# Altium project RK3568_train.PrjPcb (part 3 of 6)

## Sheet SOC_COMPHY_USB.schdoc: =
size A3; Symbol: Sheet-Symbol_A4; Company: 嘉立创EDA; Version: V1.0; Page Size: A4; @Project Name: RK3568_LPD4X_120P_Core; @Page Count: 18; @Update Date: 2025-08-22; @Create Date: 2025-08-15; @Schematic Name: Schematic1; @Page No: 8; @Page Name: SOC_COMPHY/USB; Device: Sheet-Symbol_A4; Border: 1; Title Block Position: 3; Width: 1655; Height: 1170; Region Start: 1; X Region Count: 6; Y Region Count: 4; Blade Width: 10; @Board Name: Board1; @Create Time: 13:46:06; @Update Time: 16:42:04; Organization: ORGANIZATION; Address1: ADDRESS 1; Address2: ADDRESS 2; Address3: ADDRESS 3; Address4: ADDRESS 4; Revision: V1.0.0; SheetNumber: 10; SheetTotal: 28
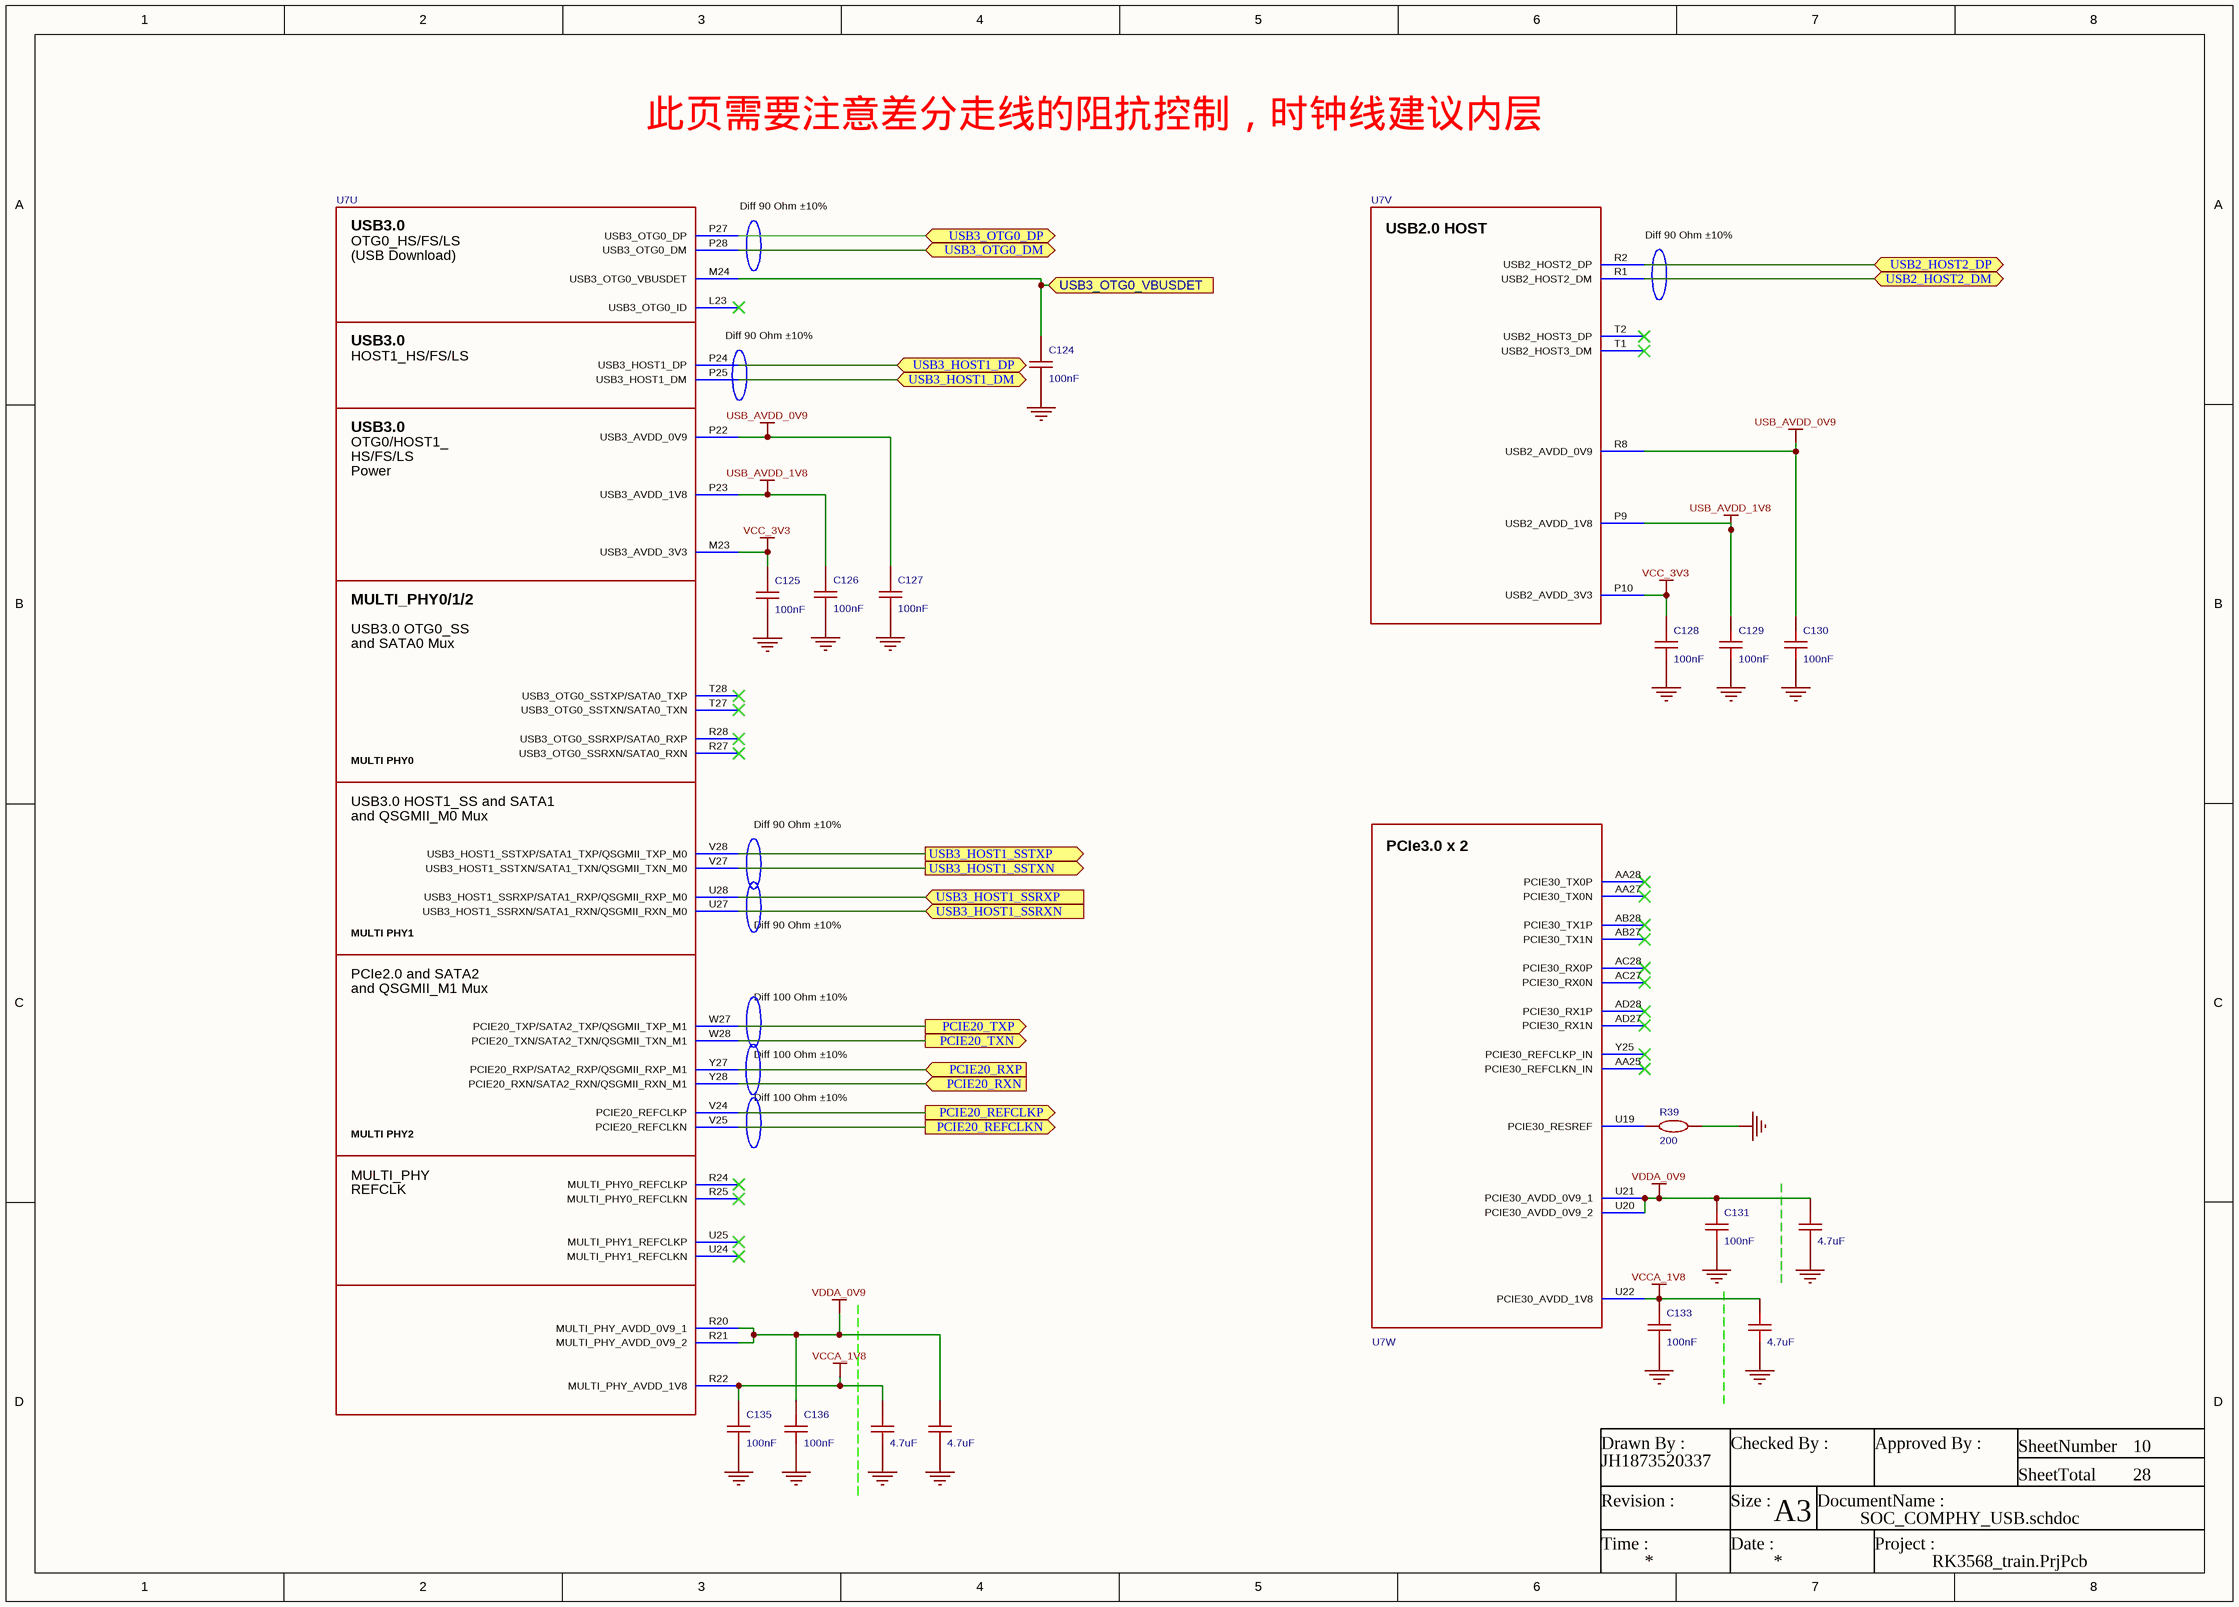
[diagram p9: SOC_COMPHY_USB.schdoc]

### Parts
C124  100nF  [C0201]
C125  100nF  [C0201]
C126  100nF  [C0201]
C127  100nF  [C0201]
C128  100nF  [C0201]
C129  100nF  [C0201]
C130  100nF  [C0201]
C131  100nF  [C0201]
C132  value 4.7uF  [MYC0402]  (hidden comment: CL10A105KB8NNNC)
C133  100nF  [C0201]
C134  value 4.7uF  [MYC0402]  (hidden comment: CL10A105KB8NNNC)
C135  100nF  [C0201]
C136  100nF  [C0201]
C137  value 4.7uF  [MYC0402]  (hidden comment: CL10A105KB8NNNC)
C138  value 4.7uF  [MYC0402]  (hidden comment: CL10A105KB8NNNC)
R39  200  [R0201]
U7  RK3568  [BGA-636_L19.0-W19.0-P0.65-BL]  (value not drawn)  (parts U,V,W of 23)

### Ports
PCIE20_REFCLKN (out), PCIE20_REFCLKP (out), PCIE20_RXN (in), PCIE20_RXP (in), PCIE20_TXN (out), PCIE20_TXP (out), USB2_HOST2_DM (bidir), USB2_HOST2_DP (bidir), USB3_HOST1_DM (bidir), USB3_HOST1_DP (bidir), USB3_HOST1_SSRXN (in), USB3_HOST1_SSRXP (in), USB3_HOST1_SSTXN (out), USB3_HOST1_SSTXP (out), USB3_OTG0_DM (bidir), USB3_OTG0_DP (bidir), USB3_OTG0_VBUSDET (in)

### Nets
GND: C124.1 C125.1 C126.1 C127.1 C128.1 C129.1 C130.1 C131.1 C132.1 C133.1 C134.1 C135.1 C136.1 C137.1 C138.1 R39.2
USB_AVDD_0V9: C127.2 C130.2 U7.P22(USB3_AVDD_0V9) U7.R8(USB2_AVDD_0V9)
USB_AVDD_1V8: C126.2 C129.2 U7.P9(USB2_AVDD_1V8) U7.P23(USB3_AVDD_1V8)
VCC_3V3: C125.2 C128.2 U7.M23(USB3_AVDD_3V3) U7.P10(USB2_AVDD_3V3)  [project net TP_3V3]
VCCA_1V8: C133.2 C134.2 C135.2 C137.2 U7.R22(MULTI_PHY_AVDD_1V8) U7.U22(PCIE30_AVDD_1V8)
VDDA_0V9: C131.2 C132.2 C136.2 C138.2 U7.R20(MULTI_PHY_AVDD_0V9_1) U7.R21(MULTI_PHY_AVDD_0V9_2) U7.U20(PCIE30_AVDD_0V9_2) U7.U21(PCIE30_AVDD_0V9_1)
PCIE20_REFCLKN: U7.V25(PCIE20_REFCLKN) ; port PCIE20_REFCLKN
PCIE20_REFCLKP: U7.V24(PCIE20_REFCLKP) ; port PCIE20_REFCLKP
PCIE20_RXN: U7.Y28(PCIE20_RXN/SATA2_RXN/QSGMII_RXN_M1) ; port PCIE20_RXN
PCIE20_RXP: U7.Y27(PCIE20_RXP/SATA2_RXP/QSGMII_RXP_M1) ; port PCIE20_RXP
PCIE20_TXN: U7.W28(PCIE20_TXN/SATA2_TXN/QSGMII_TXN_M1) ; port PCIE20_TXN
PCIE20_TXP: U7.W27(PCIE20_TXP/SATA2_TXP/QSGMII_TXP_M1) ; port PCIE20_TXP
USB2_HOST2_DM: U7.R1(USB2_HOST2_DM) ; port USB2_HOST2_DM
USB2_HOST2_DP: U7.R2(USB2_HOST2_DP) ; port USB2_HOST2_DP
USB3_HOST1_DM: U7.P25(USB3_HOST1_DM) ; port USB3_HOST1_DM
USB3_HOST1_DP: U7.P24(USB3_HOST1_DP) ; port USB3_HOST1_DP
USB3_HOST1_SSRXN: U7.U27(USB3_HOST1_SSRXN/SATA1_RXN/QSGMII_RXN_M0) ; port USB3_HOST1_SSRXN
USB3_HOST1_SSRXP: U7.U28(USB3_HOST1_SSRXP/SATA1_RXP/QSGMII_RXP_M0) ; port USB3_HOST1_SSRXP
USB3_HOST1_SSTXN: U7.V27(USB3_HOST1_SSTXN/SATA1_TXN/QSGMII_TXN_M0) ; port USB3_HOST1_SSTXN
USB3_HOST1_SSTXP: U7.V28(USB3_HOST1_SSTXP/SATA1_TXP/QSGMII_TXP_M0) ; port USB3_HOST1_SSTXP
USB3_OTG0_DM: U7.P28(USB3_OTG0_DM) ; port USB3_OTG0_DM
USB3_OTG0_DP: U7.P27(USB3_OTG0_DP) ; port USB3_OTG0_DP
USB3_OTG0_VBUSDET: C124.2 U7.M24(USB3_OTG0_VBUSDET) ; port USB3_OTG0_VBUSDET
NetR39_1: R39.1 U7.U19(PCIE30_RESREF)

Not connected (* = marked no-connect by the designer): U7 AA25(PCIE30_REFCLKN_IN)* AA27(PCIE30_TX0N)* AA28(PCIE30_TX0P)* AB27(PCIE30_TX1N)* AB28(PCIE30_TX1P)* AC27(PCIE30_RX0N)* AC28(PCIE30_RX0P)* AD27(PCIE30_RX1N)* AD28(PCIE30_RX1P)* L23(USB3_OTG0_ID)* R24(MULTI_PHY0_REFCLKP)* R25(MULTI_PHY0_REFCLKN)* R27(USB3_OTG0_SSRXN/SATA0_RXN)* R28(USB3_OTG0_SSRXP/SATA0_RXP)* T1(USB2_HOST3_DM)* T2(USB2_HOST3_DP)* T27(USB3_OTG0_SSTXN/SATA0_TXN)* T28(USB3_OTG0_SSTXP/SATA0_TXP)* U24(MULTI_PHY1_REFCLKN)* U25(MULTI_PHY1_REFCLKP)* Y25(PCIE30_REFCLKP_IN)*

### Notes on the sheet
- 此页需要注意差分走线的阻抗控制，时钟线建议内层
- (near U7) Diff 90 Ohm ±10%
- Diff 90 Ohm ±10%
- Diff 100 Ohm ±10%
- Drawn By :
- Checked By :
- Approved By :
- SheetNumber
- SheetTotal
- Revision :
- Time :
- Size :
- Date :
- A3
- DocumentName :
- Project :
- (in symbol RK3568, part U) USB3.0; OTG0_HS/FS/LS; (USB Download); HOST1_HS/FS/LS; OTG0/HOST1_; HS/FS/LS; Power; MULTI_PHY0/1/2; USB3.0 OTG0_SS; and SATA0 Mux; MULTI PHY0; USB3.0 HOST1_SS and SATA1; and QSGMII_M0 Mux; MULTI PHY1; PCIe2.0 and SATA2; and QSGMII_M1 Mux; MULTI PHY2; MULTI_PHY; REFCLK
- (in symbol RK3568, part V) USB2.0 HOST
- (in symbol RK3568, part W) PCIe3.0 x 2

### Library data of the parts
C124-C131 C133 C135 C136 = GRM035R60J475ME15D: 容值:4.7uF;精度:±20%;额定电压:6.3V;温度系数:X5R;; Manufacturer: muRata(村田); AddInBom: yes; ModelId: e8033a7cb35143ffb28e3b81b2577ea0; ModelName: C0201_L0.6-W0.3-H0.3; ModelTransform: 23.622,11.811,0,0,0,0,0,0,0; Tolerance: ±20%; Voltage Rating: 6.3V; Temperature Coefficient: X5R; Symbol: GRM035R60J475ME15D; Value: 100nF; Device: GRM035R60J475ME15D; LCSC Part Name: 4.7uF ±20% 6.3V; ManufacturerPart: GRM035R60J475ME15D; Supplier Footprint: 0201; JLCPCB Part Class: Extended Part; Datasheet: https://item.szlcsc.com/datasheet/GRM035R60J475ME15D/313624.html; Supplier: LCSC; ConvertToPcb: yes; FootprintName: C0201
C132 C134 C137 C138 = CL10A105KB8NNNC: 容值:1uF;精度:±10%;额定电压:50V;材质(温度系数):X5R;; Manufacturer: SAMSUNG(三星); Symbol: CapAcitance; 3D Model: 36a51122f27c49738f86b3bfa98863e0; AddInBom: yes; ModelName: C0603_L1.6-W0.8-H0.8; ModelTransform: 62.992,31.496,0,0,0,0,0,0,0; Tolerance: ±10%; Voltage Rated: 50V; Temperature Coefficient: X5R; Device: CL10A105KB8NNNC; LCSC Part Name: 1uF ±10% 50V; ManufacturerPart: CL10A105KB8NNNC; Supplier Footprint: 0603; JLCPCB Part Class: Basic Part; Datasheet: https://atta.szlcsc.com/upload/public/pdf/source/20160103/1457707679084.pdf; Supplier: LCSC; ConvertToPcb: yes; FootprintName: MYC0402
R39 = Res_0201: ConvertToPcb: yes; SymbolName: 电阻; ModelId: 0e006ba4c37b4b73b0e85d5d1c6800cb; ModelName: R0201_L0.6-W0.3-H0.3; ModelTransform: 23.622,11.811,0,0,0,0,0,-0.0005,0; Value: 200; Device: Res_0201; AddInBom: yes; Supplier Footprint: 0201; FootprintName: R0201
U7 = RK3568: ConvertToPcb: yes; ModelId: e6756cba1b9f43448429fdcd1d44d9d9; ModelTransform: 748.03,748.03,54.33,0,0,0,0,0,0; Symbol: RK3568; Device: RK3568; AddInBom: yes; FootprintName: BGA-636_L19.0-W19.0-P0.65-BL; ModelName: BGA-636_L19.0-W19.0-P0.65-BL

## Sheet SOC_DDR.schdoc: =
size A3; Symbol: Sheet-Symbol_A4; Company: 嘉立创EDA; Version: V1.0; Page Size: A4; @Project Name: RK3568B2地瓜派; @Page Count: 27; @Update Date: 2025-09-11; @Create Date: 2025-09-11; @Schematic Name: Schematic1; @Page No: 6; @Page Name: SOC_DDR; Device: Sheet-Symbol_A4; Border: 1; Title Block Position: 3; Width: 1655; Height: 1170; Region Start: 1; X Region Count: 6; Y Region Count: 4; Blade Width: 10; @Board Name: Board1; @Create Time: 22:14:45; @Update Time: 22:15:05; Organization: ORGANIZATION; Address1: ADDRESS 1; Address2: ADDRESS 2; Address3: ADDRESS 3; Address4: ADDRESS 4; Revision: V1.0.0; SheetNumber: 11; SheetTotal: 28
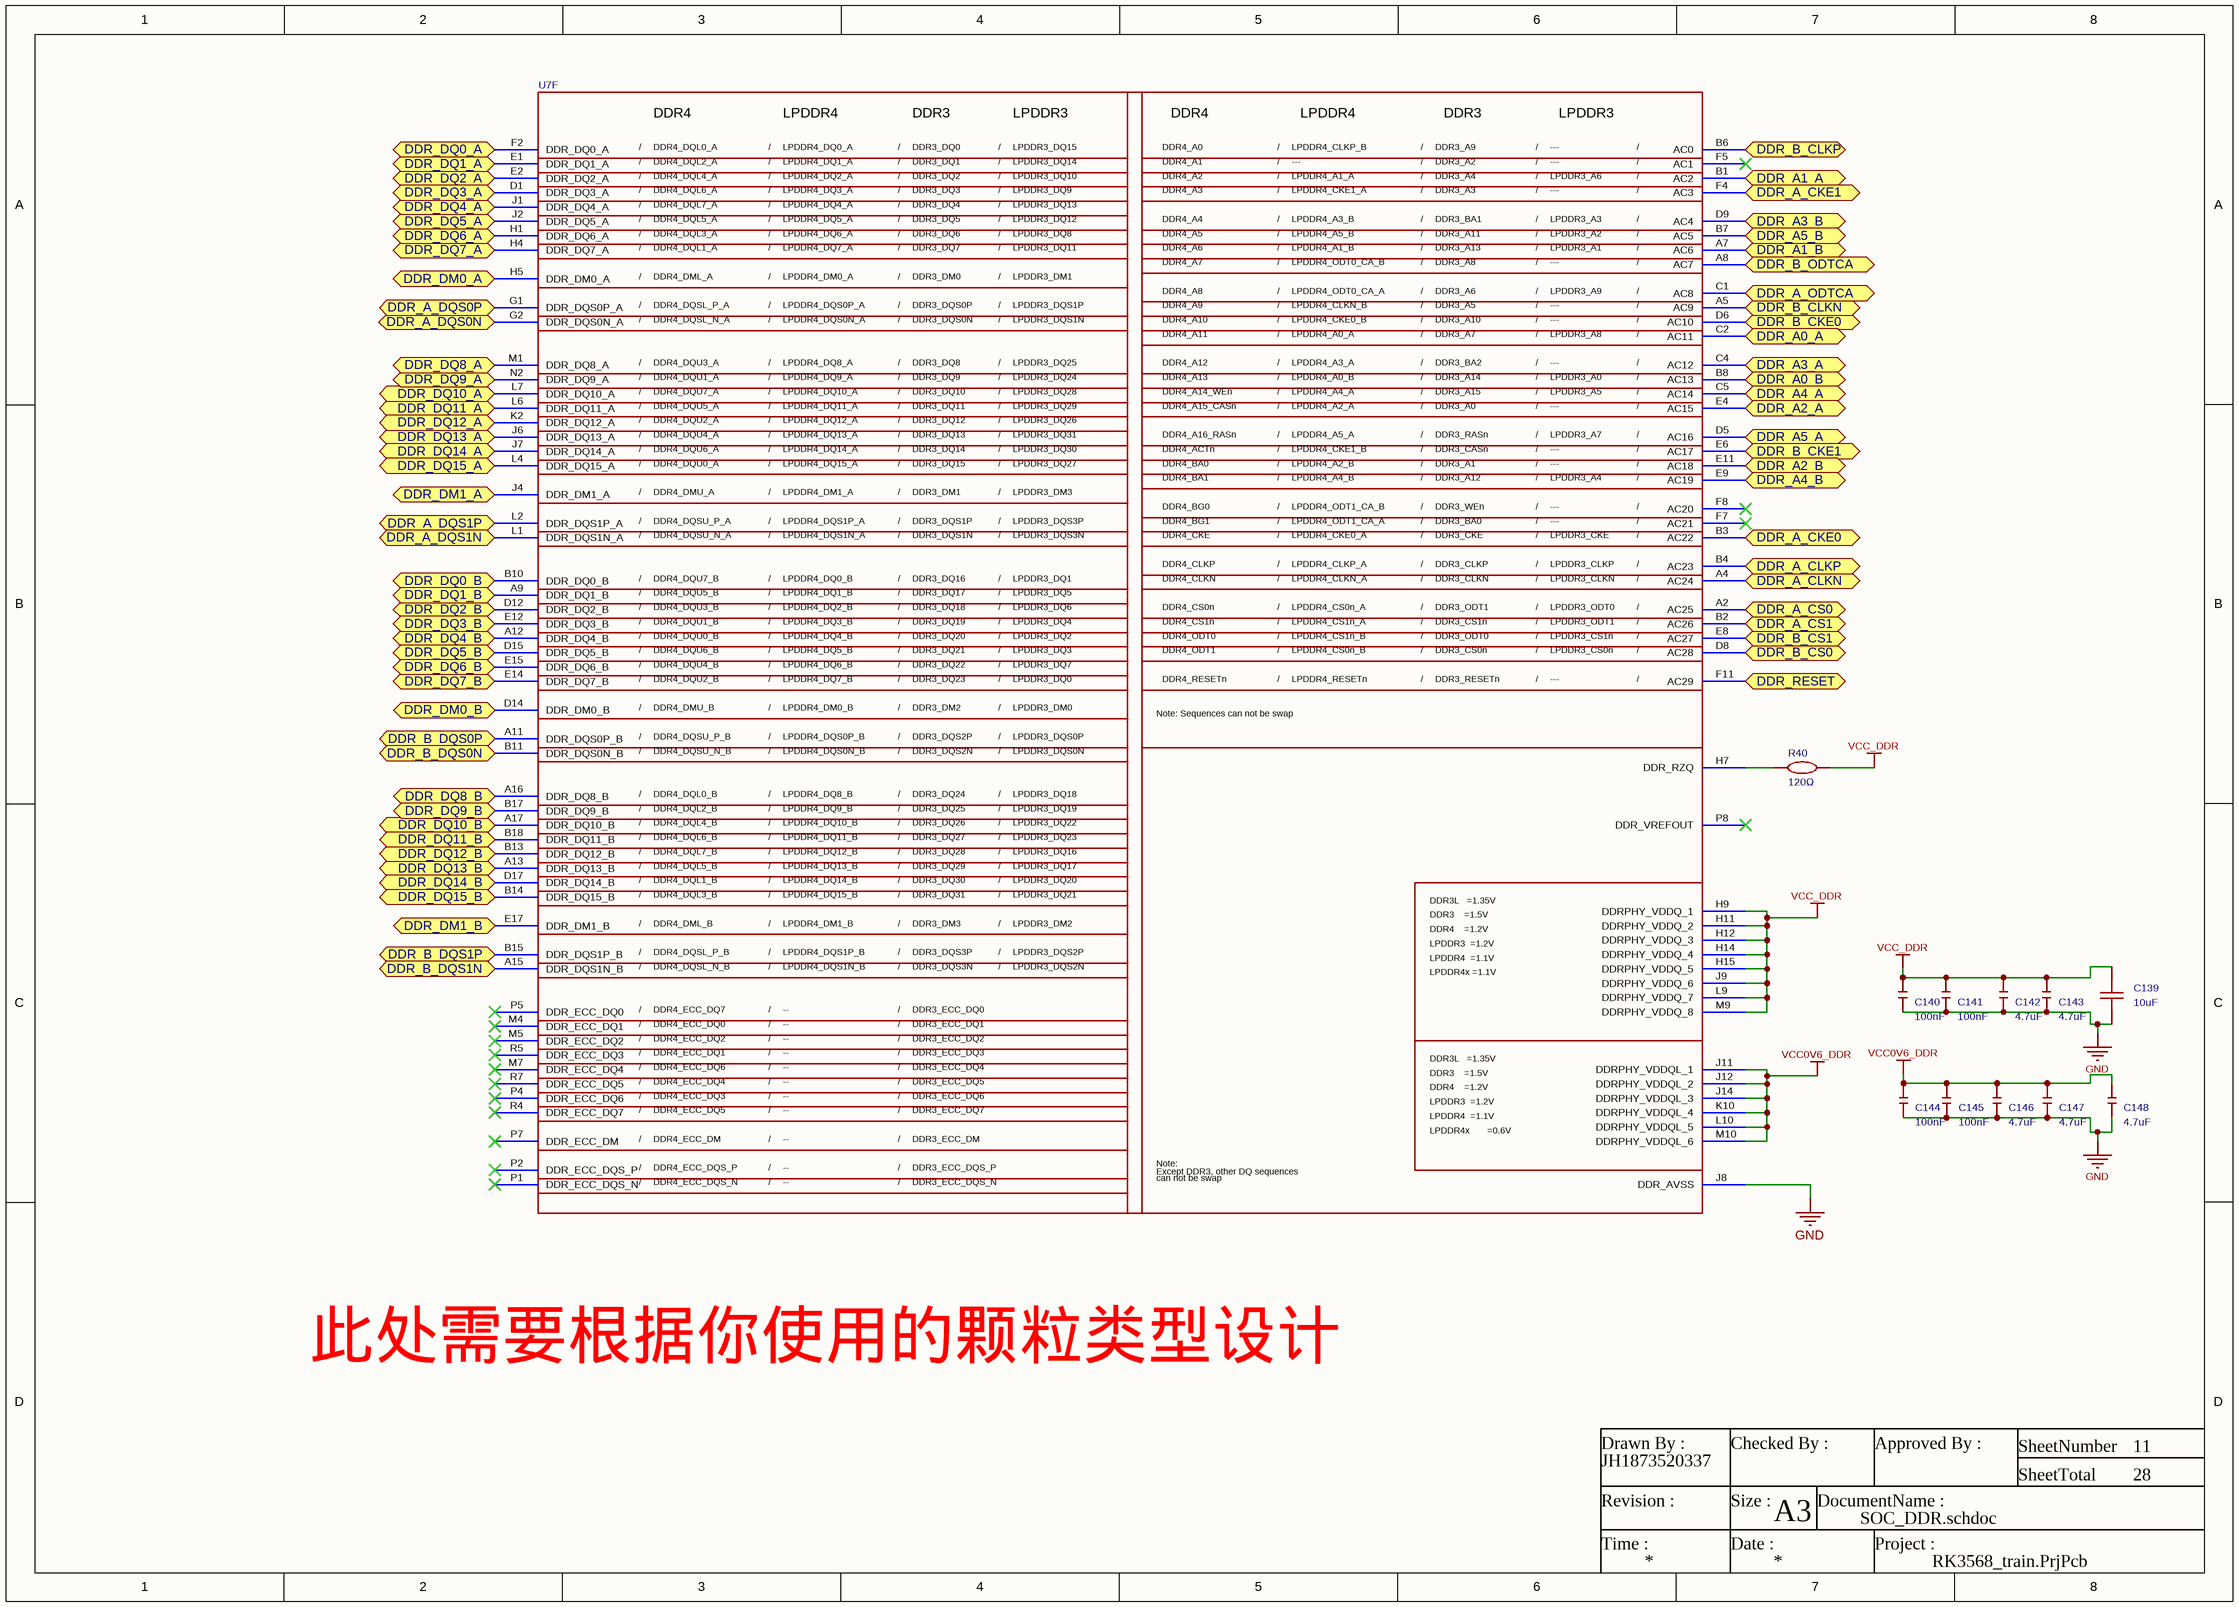
[diagram p10: SOC_DDR.schdoc]

### Parts
C139  10uF  [C0603]
C140  100nF  [MYC0201]
C141  100nF  [MYC0201]
C142  4.7uF  [MYC0402]
C143  4.7uF  [MYC0402]
C144  100nF  [MYC0201]
C145  100nF  [MYC0201]
C146  4.7uF  [MYC0402]
C147  4.7uF  [MYC0402]
C148  4.7uF  [MYC0402]
R40  120Ω  [R0201]
U7  RK3568  [BGA-636_L19.0-W19.0-P0.65-BL]  (value not drawn)  (part F of 23)

### Ports
DDR_A0_A (bidir), DDR_A0_B (bidir), DDR_A1_A (bidir), DDR_A1_B (bidir), DDR_A2_A (bidir), DDR_A2_B (bidir), DDR_A3_A (bidir), DDR_A3_B (bidir), DDR_A4_A (bidir), DDR_A4_B (bidir), DDR_A5_A (bidir), DDR_A5_B (bidir), DDR_A_CKE0 (bidir), DDR_A_CKE1 (bidir), DDR_A_CLKN (bidir), DDR_A_CLKP (bidir), DDR_A_CS0 (bidir), DDR_A_CS1 (bidir), DDR_A_DQS0N (bidir), DDR_A_DQS0P (bidir), DDR_A_DQS1N (bidir), DDR_A_DQS1P (bidir), DDR_A_ODTCA (bidir), DDR_B_CKE0 (bidir), DDR_B_CKE1 (bidir), DDR_B_CLKN (bidir), DDR_B_CLKP (bidir), DDR_B_CS0 (bidir), DDR_B_CS1 (bidir), DDR_B_DQS0N (bidir), DDR_B_DQS0P (bidir), DDR_B_DQS1N (bidir), DDR_B_DQS1P (bidir), DDR_B_ODTCA (bidir), DDR_DM0_A (bidir), DDR_DM0_B (bidir), DDR_DM1_A (bidir), DDR_DM1_B (bidir), DDR_DQ0_A (bidir), DDR_DQ0_B (bidir), DDR_DQ1_A (bidir), DDR_DQ1_B (bidir), DDR_DQ2_A (bidir), DDR_DQ2_B (bidir), DDR_DQ3_A (bidir), DDR_DQ3_B (bidir), DDR_DQ4_A (bidir), DDR_DQ4_B (bidir), DDR_DQ5_A (bidir), DDR_DQ5_B (bidir), DDR_DQ6_A (bidir), DDR_DQ6_B (bidir), DDR_DQ7_A (bidir), DDR_DQ7_B (bidir), DDR_DQ8_A (bidir), DDR_DQ8_B (bidir), DDR_DQ9_A (bidir), DDR_DQ9_B (bidir), DDR_DQ10_A (bidir), DDR_DQ10_B (bidir), DDR_DQ11_A (bidir), DDR_DQ11_B (bidir), DDR_DQ12_A (bidir), DDR_DQ12_B (bidir), DDR_DQ13_A (bidir), DDR_DQ13_B (bidir), DDR_DQ14_A (bidir), DDR_DQ14_B (bidir), DDR_DQ15_A (bidir), DDR_DQ15_B (bidir), DDR_RESET (bidir)

### Nets
GND: C139.1 C140.1 C141.1 C142.1 C143.1 C144.1 C145.1 C146.1 C147.1 C148.1 U7.J8(DDR_AVSS)
VCC0V6_DDR: C144.2 C145.2 C146.2 C147.2 C148.2 U7.J11(DDRPHY_VDDQL_1) U7.J12(DDRPHY_VDDQL_2) U7.J14(DDRPHY_VDDQL_3) U7.K10(DDRPHY_VDDQL_4) U7.L10(DDRPHY_VDDQL_5) U7.M10(DDRPHY_VDDQL_6)
VCC_DDR: C139.2 C140.2 C141.2 C142.2 C143.2 R40.2 U7.H9(DDRPHY_VDDQ_1) U7.H11(DDRPHY_VDDQ_2) U7.H12(DDRPHY_VDDQ_3) U7.H14(DDRPHY_VDDQ_4) U7.H15(DDRPHY_VDDQ_5) U7.J9(DDRPHY_VDDQ_6) U7.L9(DDRPHY_VDDQ_7) U7.M9(DDRPHY_VDDQ_8)
DDR_A0_A: U7.C2(AC11) ; port DDR_A0_A
DDR_A0_B: U7.B8(AC13) ; port DDR_A0_B
DDR_A1_A: U7.B1(AC2) ; port DDR_A1_A
DDR_A1_B: U7.A7(AC6) ; port DDR_A1_B
DDR_A2_A: U7.E4(AC15) ; port DDR_A2_A
DDR_A2_B: U7.E11(AC18) ; port DDR_A2_B
DDR_A3_A: U7.C4(AC12) ; port DDR_A3_A
DDR_A3_B: U7.D9(AC4) ; port DDR_A3_B
DDR_A4_A: U7.C5(AC14) ; port DDR_A4_A
DDR_A4_B: U7.E9(AC19) ; port DDR_A4_B
DDR_A5_A: U7.D5(AC16) ; port DDR_A5_A
DDR_A5_B: U7.B7(AC5) ; port DDR_A5_B
DDR_A_CKE0: U7.B3(AC22) ; port DDR_A_CKE0
DDR_A_CKE1: U7.F4(AC3) ; port DDR_A_CKE1
DDR_A_CLKN: U7.A4(AC24) ; port DDR_A_CLKN
DDR_A_CLKP: U7.B4(AC23) ; port DDR_A_CLKP
DDR_A_CS0: U7.A2(AC25) ; port DDR_A_CS0
DDR_A_CS1: U7.B2(AC26) ; port DDR_A_CS1
DDR_A_DQS0N: U7.G2(DDR_DQS0N_A) ; port DDR_A_DQS0N
DDR_A_DQS0P: U7.G1(DDR_DQS0P_A) ; port DDR_A_DQS0P
DDR_A_DQS1N: U7.L1(DDR_DQS1N_A) ; port DDR_A_DQS1N
DDR_A_DQS1P: U7.L2(DDR_DQS1P_A) ; port DDR_A_DQS1P
DDR_A_ODTCA: U7.C1(AC8) ; port DDR_A_ODTCA
DDR_B_CKE0: U7.D6(AC10) ; port DDR_B_CKE0
DDR_B_CKE1: U7.E6(AC17) ; port DDR_B_CKE1
DDR_B_CLKN: U7.A5(AC9) ; port DDR_B_CLKN
DDR_B_CLKP: U7.B6(AC0) ; port DDR_B_CLKP
DDR_B_CS0: U7.D8(AC28) ; port DDR_B_CS0
DDR_B_CS1: U7.E8(AC27) ; port DDR_B_CS1
DDR_B_DQS0N: U7.B11(DDR_DQS0N_B) ; port DDR_B_DQS0N
DDR_B_DQS0P: U7.A11(DDR_DQS0P_B) ; port DDR_B_DQS0P
DDR_B_DQS1N: U7.A15(DDR_DQS1N_B) ; port DDR_B_DQS1N
DDR_B_DQS1P: U7.B15(DDR_DQS1P_B) ; port DDR_B_DQS1P
DDR_B_ODTCA: U7.A8(AC7) ; port DDR_B_ODTCA
DDR_DM0_A: U7.H5(DDR_DM0_A) ; port DDR_DM0_A
DDR_DM0_B: U7.D14(DDR_DM0_B) ; port DDR_DM0_B
DDR_DM1_A: U7.J4(DDR_DM1_A) ; port DDR_DM1_A
DDR_DM1_B: U7.E17(DDR_DM1_B) ; port DDR_DM1_B
DDR_DQ0_A: U7.F2(DDR_DQ0_A) ; port DDR_DQ0_A
DDR_DQ0_B: U7.B10(DDR_DQ0_B) ; port DDR_DQ0_B
DDR_DQ1_A: U7.E1(DDR_DQ1_A) ; port DDR_DQ1_A
DDR_DQ1_B: U7.A9(DDR_DQ1_B) ; port DDR_DQ1_B
DDR_DQ2_A: U7.E2(DDR_DQ2_A) ; port DDR_DQ2_A
DDR_DQ2_B: U7.D12(DDR_DQ2_B) ; port DDR_DQ2_B
DDR_DQ3_A: U7.D1(DDR_DQ3_A) ; port DDR_DQ3_A
DDR_DQ3_B: U7.E12(DDR_DQ3_B) ; port DDR_DQ3_B
DDR_DQ4_A: U7.J1(DDR_DQ4_A) ; port DDR_DQ4_A
DDR_DQ4_B: U7.A12(DDR_DQ4_B) ; port DDR_DQ4_B
DDR_DQ5_A: U7.J2(DDR_DQ5_A) ; port DDR_DQ5_A
DDR_DQ5_B: U7.D15(DDR_DQ5_B) ; port DDR_DQ5_B
DDR_DQ6_A: U7.H1(DDR_DQ6_A) ; port DDR_DQ6_A
DDR_DQ6_B: U7.E15(DDR_DQ6_B) ; port DDR_DQ6_B
DDR_DQ7_A: U7.H4(DDR_DQ7_A) ; port DDR_DQ7_A
DDR_DQ7_B: U7.E14(DDR_DQ7_B) ; port DDR_DQ7_B
DDR_DQ8_A: U7.M1(DDR_DQ8_A) ; port DDR_DQ8_A
DDR_DQ8_B: U7.A16(DDR_DQ8_B) ; port DDR_DQ8_B
DDR_DQ9_A: U7.N2(DDR_DQ9_A) ; port DDR_DQ9_A
DDR_DQ9_B: U7.B17(DDR_DQ9_B) ; port DDR_DQ9_B
DDR_DQ10_A: U7.L7(DDR_DQ10_A) ; port DDR_DQ10_A
DDR_DQ10_B: U7.A17(DDR_DQ10_B) ; port DDR_DQ10_B
DDR_DQ11_A: U7.L6(DDR_DQ11_A) ; port DDR_DQ11_A
DDR_DQ11_B: U7.B18(DDR_DQ11_B) ; port DDR_DQ11_B
DDR_DQ12_A: U7.K2(DDR_DQ12_A) ; port DDR_DQ12_A
DDR_DQ12_B: U7.B13(DDR_DQ12_B) ; port DDR_DQ12_B
DDR_DQ13_A: U7.J6(DDR_DQ13_A) ; port DDR_DQ13_A
DDR_DQ13_B: U7.A13(DDR_DQ13_B) ; port DDR_DQ13_B
DDR_DQ14_A: U7.J7(DDR_DQ14_A) ; port DDR_DQ14_A
DDR_DQ14_B: U7.D17(DDR_DQ14_B) ; port DDR_DQ14_B
DDR_DQ15_A: U7.L4(DDR_DQ15_A) ; port DDR_DQ15_A
DDR_DQ15_B: U7.B14(DDR_DQ15_B) ; port DDR_DQ15_B
DDR_RESET: U7.F11(AC29) ; port DDR_RESET
NetR40_1: R40.1 U7.H7(DDR_RZQ)

Not connected (* = marked no-connect by the designer): U7 F5(AC1)* F7(AC21)* F8(AC20)* M4(DDR_ECC_DQ1)* M5(DDR_ECC_DQ2)* M7(DDR_ECC_DQ4)* P1(DDR_ECC_DQS_N)* P2(DDR_ECC_DQS_P)* P4(DDR_ECC_DQ6)* P5(DDR_ECC_DQ0)* P7(DDR_ECC_DM)* P8(DDR_VREFOUT)* R4(DDR_ECC_DQ7)* R5(DDR_ECC_DQ3)* R7(DDR_ECC_DQ5)*

### Notes on the sheet
- 此处需要根据你使用的颗粒类型设计
- Drawn By :
- Checked By :
- Approved By :
- SheetNumber
- SheetTotal
- Revision :
- Time :
- Size :
- Date :
- A3
- DocumentName :
- Project :
- (in symbol RK3568, part F) DDR4; LPDDR4; DDR3; LPDDR3; /; DDR4_DQL0_A; LPDDR4_DQ0_A; DDR3_DQ0; LPDDR3_DQ15; DDR4_A0; LPDDR4_CLKP_B; DDR3_A9; ---; DDR4_DQL2_A; LPDDR4_DQ1_A; DDR3_DQ1; LPDDR3_DQ14; DDR4_A1; DDR3_A2; DDR4_DQL4_A; LPDDR4_DQ2_A; DDR3_DQ2; LPDDR3_DQ10; DDR4_A2; LPDDR4_A1_A; DDR3_A4; LPDDR3_A6; DDR4_DQL6_A; LPDDR4_DQ3_A; DDR3_DQ3; LPDDR3_DQ9; DDR4_A3; LPDDR4_CKE1_A; DDR3_A3; DDR4_DQL7_A; LPDDR4_DQ4_A; DDR3_DQ4; LPDDR3_DQ13; DDR4_DQL5_A; LPDDR4_DQ5_A; DDR3_DQ5; LPDDR3_DQ12; DDR4_A4; LPDDR4_A3_B; DDR3_BA1; LPDDR3_A3; DDR4_DQL3_A; LPDDR4_DQ6_A; DDR3_DQ6; LPDDR3_DQ8; DDR4_A5; LPDDR4_A5_B; DDR3_A11; LPDDR3_A2; DDR4_DQL1_A; LPDDR4_DQ7_A; DDR3_DQ7; LPDDR3_DQ11; DDR4_A6; LPDDR4_A1_B; DDR3_A13; LPDDR3_A1; DDR4_A7; LPDDR4_ODT0_CA_B; DDR3_A8; DDR4_DML_A; LPDDR4_DM0_A; DDR3_DM0; LPDDR3_DM1; DDR4_A8; LPDDR4_ODT0_CA_A; DDR3_A6; LPDDR3_A9; DDR4_DQSL_P_A; LPDDR4_DQS0P_A; DDR3_DQS0P; LPDDR3_DQS1P; DDR4_A9; LPDDR4_CLKN_B; DDR3_A5; DDR4_DQSL_N_A; LPDDR4_DQS0N_A; DDR3_DQS0N; LPDDR3_DQS1N; DDR4_A10; LPDDR4_CKE0_B; DDR3_A10; DDR4_A11; LPDDR4_A0_A; DDR3_A7; LPDDR3_A8; DDR4_DQU3_A; LPDDR4_DQ8_A; DDR3_DQ8; LPDDR3_DQ25; DDR4_A12; LPDDR4_A3_A; DDR3_BA2; DDR4_DQU1_A; LPDDR4_DQ9_A; DDR3_DQ9; LPDDR3_DQ24; DDR4_A13; LPDDR4_A0_B; DDR3_A14; LPDDR3_A0; DDR4_DQU7_A; LPDDR4_DQ10_A; DDR3_DQ10; LPDDR3_DQ28; DDR4_A14_WEn; LPDDR4_A4_A; DDR3_A15; LPDDR3_A5; DDR4_DQU5_A; LPDDR4_DQ11_A; DDR3_DQ11; LPDDR3_DQ29; DDR4_A15_CASn; LPDDR4_A2_A; DDR3_A0; DDR4_DQU2_A; LPDDR4_DQ12_A; DDR3_DQ12; LPDDR3_DQ26; DDR4_DQU4_A; LPDDR4_DQ13_A; DDR3_DQ13; LPDDR3_DQ31; DDR4_A16_RASn; LPDDR4_A5_A; DDR3_RASn; LPDDR3_A7; DDR4_DQU6_A; LPDDR4_DQ14_A; DDR3_DQ14; LPDDR3_DQ30; DDR4_ACTn; LPDDR4_CKE1_B; DDR3_CASn; DDR4_DQU0_A; LPDDR4_DQ15_A; DDR3_DQ15; LPDDR3_DQ27; DDR4_BA0; LPDDR4_A2_B; DDR3_A1; DDR4_BA1; LPDDR4_A4_B; DDR3_A12; LPDDR3_A4; DDR4_DMU_A; LPDDR4_DM1_A; DDR3_DM1; LPDDR3_DM3; DDR4_BG0; LPDDR4_ODT1_CA_B; DDR3_WEn; DDR4_DQSU_P_A; LPDDR4_DQS1P_A; DDR3_DQS1P; LPDDR3_DQS3P; DDR4_BG1; LPDDR4_ODT1_CA_A; DDR3_BA0; DDR4_DQSU_N_A; LPDDR4_DQS1N_A; DDR3_DQS1N; LPDDR3_DQS3N; DDR4_CKE; LPDDR4_CKE0_A; DDR3_CKE; LPDDR3_CKE; DDR4_CLKP; LPDDR4_CLKP_A; DDR3_CLKP; LPDDR3_CLKP; DDR4_DQU7_B; LPDDR4_DQ0_B; DDR3_DQ16; LPDDR3_DQ1; DDR4_CLKN; LPDDR4_CLKN_A; DDR3_CLKN; LPDDR3_CLKN; DDR4_DQU5_B; LPDDR4_DQ1_B; DDR3_DQ17; LPDDR3_DQ5; DDR4_DQU3_B; LPDDR4_DQ2_B; DDR3_DQ18; LPDDR3_DQ6; DDR4_CS0n; LPDDR4_CS0n_A; DDR3_ODT1; LPDDR3_ODT0; DDR4_DQU1_B; LPDDR4_DQ3_B; DDR3_DQ19; LPDDR3_DQ4; DDR4_CS1n; LPDDR4_CS1n_A; DDR3_CS1n; LPDDR3_ODT1; DDR4_DQU0_B; LPDDR4_DQ4_B; DDR3_DQ20; LPDDR3_DQ2; DDR4_ODT0; LPDDR4_CS1n_B; DDR3_ODT0; LPDDR3_CS1n; DDR4_DQU6_B; LPDDR4_DQ5_B; DDR3_DQ21; LPDDR3_DQ3; DDR4_ODT1; LPDDR4_CS0n_B; DDR3_CS0n; LPDDR3_CS0n; DDR4_DQU4_B; LPDDR4_DQ6_B; DDR3_DQ22; LPDDR3_DQ7; DDR4_DQU2_B; LPDDR4_DQ7_B; DDR3_DQ23; LPDDR3_DQ0; DDR4_RESETn; LPDDR4_RESETn; DDR3_RESETn; DDR4_DMU_B; LPDDR4_DM0_B; DDR3_DM2; LPDDR3_DM0; Note: Sequences can not be swap; DDR4_DQSU_P_B; LPDDR4_DQS0P_B; DDR3_DQS2P; LPDDR3_DQS0P; DDR4_DQSU_N_B; LPDDR4_DQS0N_B; DDR3_DQS2N; LPDDR3_DQS0N; DDR4_DQL0_B; LPDDR4_DQ8_B; DDR3_DQ24; LPDDR3_DQ18; DDR4_DQL2_B; LPDDR4_DQ9_B; DDR3_DQ25; LPDDR3_DQ19; DDR4_DQL4_B; LPDDR4_DQ10_B; DDR3_DQ26; LPDDR3_DQ22; DDR4_DQL6_B; LPDDR4_DQ11_B; DDR3_DQ27; LPDDR3_DQ23; DDR4_DQL7_B; LPDDR4_DQ12_B; DDR3_DQ28; LPDDR3_DQ16; DDR4_DQL5_B; LPDDR4_DQ13_B; DDR3_DQ29; LPDDR3_DQ17; DDR4_DQL1_B; LPDDR4_DQ14_B; DDR3_DQ30; LPDDR3_DQ20; DDR4_DQL3_B; LPDDR4_DQ15_B; DDR3_DQ31; LPDDR3_DQ21; DDR3L   =1.35V; DDR3    =1.5V; DDR4_DML_B; LPDDR4_DM1_B; DDR3_DM3; LPDDR3_DM2; DDR4    =1.2V; LPDDR3  =1.2V; DDR4_DQSL_P_B; LPDDR4_DQS1P_B; DDR3_DQS3P; LPDDR3_DQS2P; LPDDR4  =1.1V; DDR4_DQSL_N_B; LPDDR4_DQS1N_B; DDR3_DQS3N; LPDDR3_DQS2N; LPDDR4x =1.1V; DDR4_ECC_DQ7; --; DDR3_ECC_DQ0; DDR4_ECC_DQ0; DDR3_ECC_DQ1; DDR4_ECC_DQ2; DDR3_ECC_DQ2; DDR4_ECC_DQ1; DDR3_ECC_DQ3; DDR4_ECC_DQ6; DDR3_ECC_DQ4; DDR4_ECC_DQ4; DDR3_ECC_DQ5; DDR4_ECC_DQ3; DDR3_ECC_DQ6; DDR4_ECC_DQ5; DDR3_ECC_DQ7; LPDDR4x; DDR4_ECC_DM; DDR3_ECC_DM; Note:; DDR4_ECC_DQS_P; DDR3_ECC_DQS_P; Except DDR3, other DQ sequences; can not be swap; DDR4_ECC_DQS_N; DDR3_ECC_DQS_N

### Library data of the parts
C139 = CAP_0603: Symbol: Capacitance; 3D Model: ac125912035d415993ca9572d50418b1聨0819f05c4eef4c71ace90d822a990e87; 3D Model Transform: 62.992,31.496,0,0,0,0,0,0,0; ConvertToPcb: yes; ModelName: C0603_L1.6-W0.8-H0.8; Device: CAP_0603; Supplier Footprint: 0603; Value: 10uF; AddInBom: yes; FootprintName: C0603
C140 C141 C144 C145 = MY_C0201: my0201; AddInBom: yes; ModelId: 7899b263465b4be781422057da338961聨0819f05c4eef4c71ace90d822a990e87; ModelName: C0201; ModelTransform: 23.622000938653944,11.811000469326972,11.811000469326972,0,0,0,0,0,0; Symbol: MY_C0201; Device: MY_C0201; Value: 100nF; FootprintName: MYC0201; ConvertToPcb: yes
C142 C143 C146-C148 = MYC0402: C0402电容; Symbol: MY_C0201; AddInBom: yes; Device: MYC0402; Value: 4.7uF; ConvertToPcb: yes; FootprintName: MYC0402
R40 = Res_0201: Symbol: 电阻; 3D Model: 0e006ba4c37b4b73b0e85d5d1c6800cb; 3D Model Transform: 23.622,11.811,0,0,0,0,0,-0.0005,0; ConvertToPcb: yes; ModelName: R0201_L0.6-W0.3-H0.3; Device: Res_0201; Supplier Footprint: 0201; Value: 120Ω; AddInBom: yes; FootprintName: R0201
U7 = RK3568: as U7 on sheet SOC_COMPHY_USB; Symbol: RK3568; Device: RK3568; AddInBom: yes; FootprintName: BGA-636_L19.0-W19.0-P0.65-BL; ModelName: BGA-636_L19.0-W19.0-P0.65-BL

## Sheet SOC_DISPLAY.schdoc: =
size A3; Symbol: Sheet-Symbol_A4; Company: 嘉立创EDA; Version: V1.0; Page Size: A4; @Project Name: RK3568_LPD4X_120P_Core; @Page Count: 18; @Update Date: 2025-08-25; @Create Date: 2025-08-15; @Schematic Name: Schematic1; @Page No: 10; @Page Name: SOC_DISPLAY; Device: Sheet-Symbol_A4; Border: 1; Title Block Position: 3; Width: 1655; Height: 1170; Region Start: 1; X Region Count: 6; Y Region Count: 4; Blade Width: 10; @Board Name: Board1; @Create Time: 15:00:32; @Update Time: 13:23:47; Organization: ORGANIZATION; Address1: ADDRESS 1; Address2: ADDRESS 2; Address3: ADDRESS 3; Address4: ADDRESS 4; Revision: V1.0.0; SheetNumber: 12; SheetTotal: 28
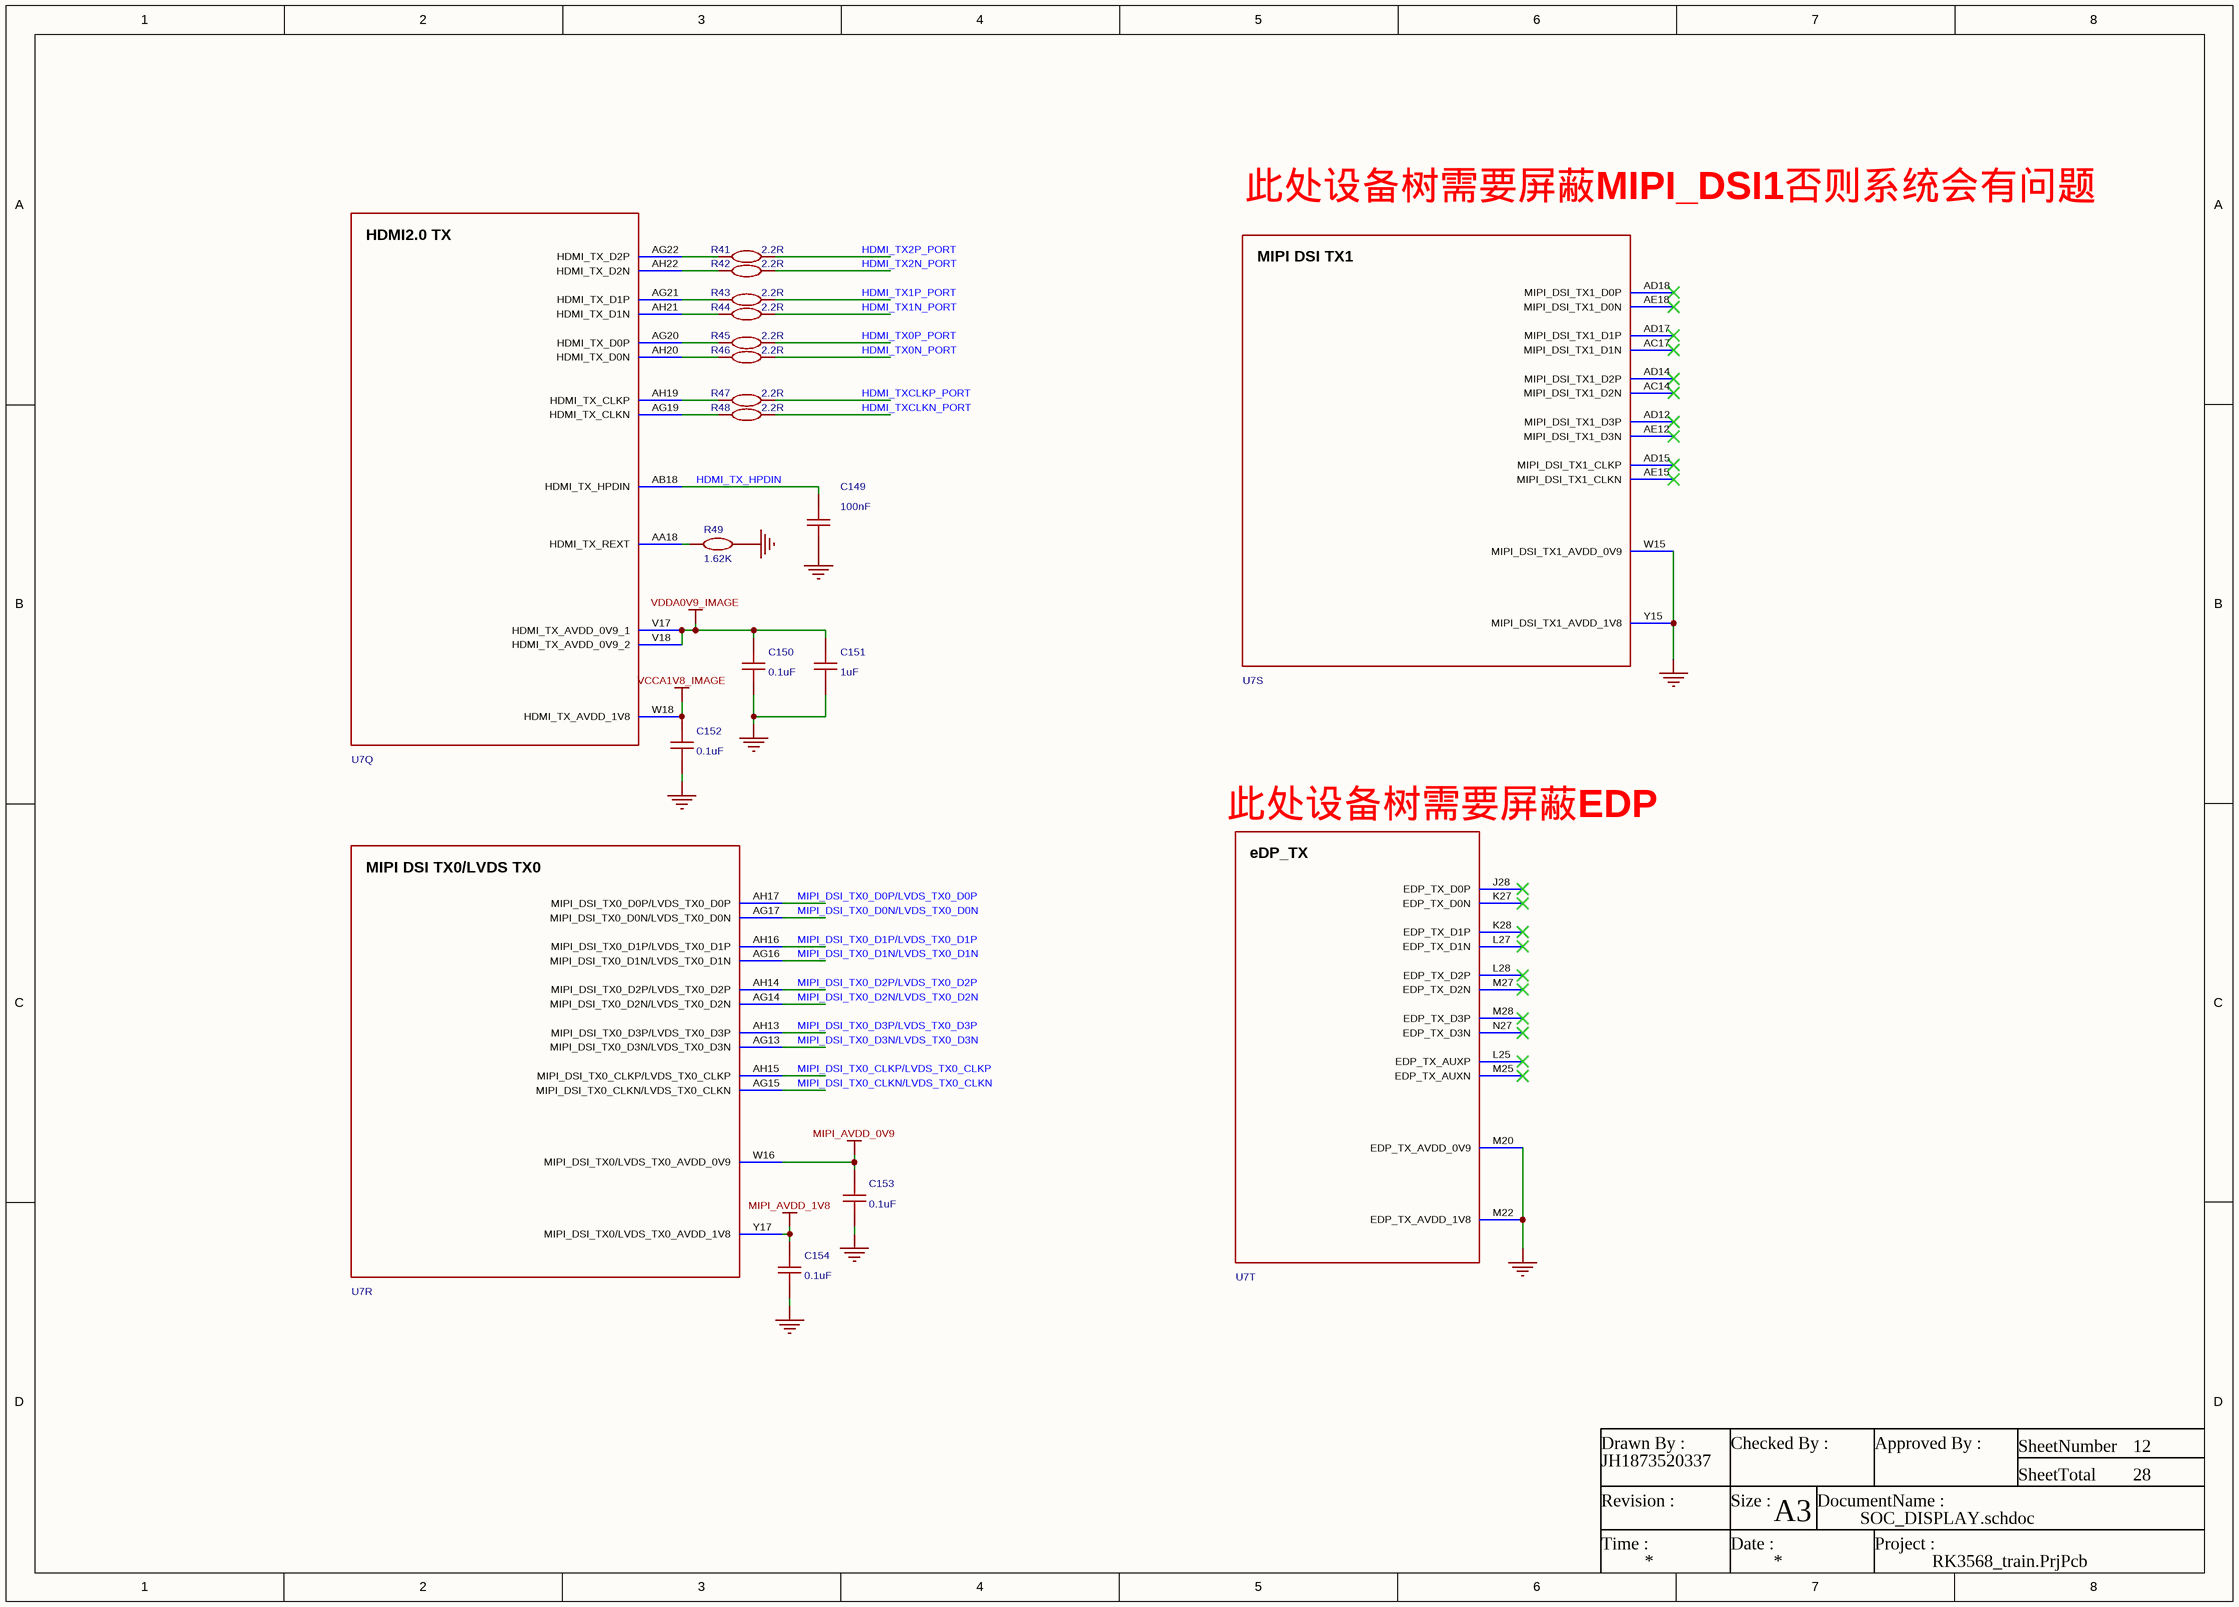
[diagram p11: SOC_DISPLAY.schdoc]

### Parts
C149  100nF  [C0201]
C150  0.1uF  [C0201]
C151  1uF  [C0201]
C152  0.1uF  [C0201]
C153  0.1uF  [C0201]
C154  0.1uF  [C0201]
R41  2.2R  [R0201]
R42  2.2R  [R0201]
R43  2.2R  [R0201]
R44  2.2R  [R0201]
R45  2.2R  [R0201]
R46  2.2R  [R0201]
R47  2.2R  [R0201]
R48  2.2R  [R0201]
R49  1.62K  [R0201]
U7  RK3568  [BGA-636_L19.0-W19.0-P0.65-BL]  (value not drawn)  (parts Q,R,S,T of 23)

### Nets
GND: C149.1 C150.1 C151.1 C152.1 C153.1 C154.1 R49.2 U7.M20(EDP_TX_AVDD_0V9) U7.M22(EDP_TX_AVDD_1V8) U7.W15(MIPI_DSI_TX1_AVDD_0V9) U7.Y15(MIPI_DSI_TX1_AVDD_1V8)
MIPI_AVDD_0V9: C153.2 U7.W16(MIPI_DSI_TX0/LVDS_TX0_AVDD_0V9)
MIPI_AVDD_1V8: C154.2 U7.Y17(MIPI_DSI_TX0/LVDS_TX0_AVDD_1V8)
VCCA1V8_IMAGE: C152.2 U7.W18(HDMI_TX_AVDD_1V8)
VDDA0V9_IMAGE: C150.2 C151.2 U7.V17(HDMI_TX_AVDD_0V9_1) U7.V18(HDMI_TX_AVDD_0V9_2)
HDMI_TX0N_PORT: R46.2
HDMI_TX0P_PORT: R45.2
HDMI_TX1N_PORT: R44.2
HDMI_TX1P_PORT: R43.2
HDMI_TX2N_PORT: R42.2
HDMI_TX2P_PORT: R41.2
HDMI_TX_HPDIN: C149.2 U7.AB18(HDMI_TX_HPDIN)
HDMI_TXCLKN_PORT: R48.2
HDMI_TXCLKP_PORT: R47.2
MIPI_DSI_TX0_CLKN/LVDS_TX0_CLKN: U7.AG15(MIPI_DSI_TX0_CLKN/LVDS_TX0_CLKN)  [project net LCD_CKN]
MIPI_DSI_TX0_CLKP/LVDS_TX0_CLKP: U7.AH15(MIPI_DSI_TX0_CLKP/LVDS_TX0_CLKP)  [project net LCD_CKP]
MIPI_DSI_TX0_D0N/LVDS_TX0_D0N: U7.AG17(MIPI_DSI_TX0_D0N/LVDS_TX0_D0N)  [project net LCD_D0N]
MIPI_DSI_TX0_D0P/LVDS_TX0_D0P: U7.AH17(MIPI_DSI_TX0_D0P/LVDS_TX0_D0P)  [project net LCD_D0P]
MIPI_DSI_TX0_D1N/LVDS_TX0_D1N: U7.AG16(MIPI_DSI_TX0_D1N/LVDS_TX0_D1N)  [project net LCD_D1N]
MIPI_DSI_TX0_D1P/LVDS_TX0_D1P: U7.AH16(MIPI_DSI_TX0_D1P/LVDS_TX0_D1P)  [project net LCD_D1P]
MIPI_DSI_TX0_D2N/LVDS_TX0_D2N: U7.AG14(MIPI_DSI_TX0_D2N/LVDS_TX0_D2N)  [project net LCD_D2N]
MIPI_DSI_TX0_D2P/LVDS_TX0_D2P: U7.AH14(MIPI_DSI_TX0_D2P/LVDS_TX0_D2P)  [project net LCD_D2P]
MIPI_DSI_TX0_D3N/LVDS_TX0_D3N: U7.AG13(MIPI_DSI_TX0_D3N/LVDS_TX0_D3N)  [project net LCD_D3N]
MIPI_DSI_TX0_D3P/LVDS_TX0_D3P: U7.AH13(MIPI_DSI_TX0_D3P/LVDS_TX0_D3P)  [project net LCD_D3P]
NetR41_1: R41.1 U7.AG22(HDMI_TX_D2P)
NetR42_1: R42.1 U7.AH22(HDMI_TX_D2N)
NetR43_1: R43.1 U7.AG21(HDMI_TX_D1P)
NetR44_1: R44.1 U7.AH21(HDMI_TX_D1N)
NetR45_1: R45.1 U7.AG20(HDMI_TX_D0P)
NetR46_1: R46.1 U7.AH20(HDMI_TX_D0N)
NetR47_1: R47.1 U7.AH19(HDMI_TX_CLKP)
NetR48_1: R48.1 U7.AG19(HDMI_TX_CLKN)
NetR49_1: R49.1 U7.AA18(HDMI_TX_REXT)

Not connected (* = marked no-connect by the designer): U7 AC14(MIPI_DSI_TX1_D2N)* AC17(MIPI_DSI_TX1_D1N)* AD12(MIPI_DSI_TX1_D3P)* AD14(MIPI_DSI_TX1_D2P)* AD15(MIPI_DSI_TX1_CLKP)* AD17(MIPI_DSI_TX1_D1P)* AD18(MIPI_DSI_TX1_D0P)* AE12(MIPI_DSI_TX1_D3N)* AE15(MIPI_DSI_TX1_CLKN)* AE18(MIPI_DSI_TX1_D0N)* J28(EDP_TX_D0P)* K27(EDP_TX_D0N)* K28(EDP_TX_D1P)* L25(EDP_TX_AUXP)* L27(EDP_TX_D1N)* L28(EDP_TX_D2P)* M25(EDP_TX_AUXN)* M27(EDP_TX_D2N)* M28(EDP_TX_D3P)* N27(EDP_TX_D3N)*

### Notes on the sheet
- 此处设备树需要屏蔽MIPI_DSI1否则系统会有问题
- 此处设备树需要屏蔽EDP
- Drawn By :
- Checked By :
- Approved By :
- SheetNumber
- SheetTotal
- Revision :
- Time :
- Size :
- Date :
- A3
- DocumentName :
- Project :
- (in symbol RK3568, part Q) HDMI2.0 TX
- (in symbol RK3568, part R) MIPI DSI TX0/LVDS TX0
- (in symbol RK3568, part S) MIPI DSI TX1
- (in symbol RK3568, part T) eDP_TX

### Library data of the parts
C149-C154 = GRM035R60J475ME15D: as C124-C131 on sheet SOC_COMPHY_USB; Symbol: GRM035R60J475ME15D; Device: GRM035R60J475ME15D; LCSC Part Name: 4.7uF ±20% 6.3V; ManufacturerPart: GRM035R60J475ME15D; Supplier Footprint: 0201; JLCPCB Part Class: Extended Part; Datasheet: https://item.szlcsc.com/datasheet/GRM035R60J475ME15D/313624.html; Supplier: LCSC; ConvertToPcb: yes; FootprintName: C0201
  C149: Value: 100nF
  C150 C152-C154: Value: 0.1uF
  C151: Value: 1uF
R41-R48 = Res_0201: as R40 on sheet SOC_DDR; Device: Res_0201; Supplier Footprint: 0201; Value: 2.2R; AddInBom: yes; FootprintName: R0201
R49 = Res_0201: as R39 on sheet SOC_COMPHY_USB; Value: 1.62K; Device: Res_0201; AddInBom: yes; Supplier Footprint: 0201; FootprintName: R0201
U7 = RK3568: as U7 on sheet SOC_COMPHY_USB; Symbol: RK3568; Device: RK3568; AddInBom: yes; FootprintName: BGA-636_L19.0-W19.0-P0.65-BL; ModelName: BGA-636_L19.0-W19.0-P0.65-BL

## Sheet SOC_FLASH.schdoc: =
size A3; Symbol: Sheet-Symbol_A4; Company: 嘉立创EDA; Version: V1.0; Page Size: A4; @Project Name: RK3568_LPD4X_120P_Core; @Page Count: 18; @Update Date: 2025-08-24; @Create Date: 2025-08-15; @Schematic Name: Schematic1; @Page No: 7; @Page Name: SOC_FLASH; Device: Sheet-Symbol_A4; Border: 1; Title Block Position: 3; Width: 1655; Height: 1170; Region Start: 1; X Region Count: 6; Y Region Count: 4; Blade Width: 10; @Board Name: Board1; @Create Time: 13:45:50; @Update Time: 13:20:27; Organization: ORGANIZATION; Address1: ADDRESS 1; Address2: ADDRESS 2; Address3: ADDRESS 3; Address4: ADDRESS 4; Revision: V1.0.0; SheetNumber: 13; SheetTotal: 28
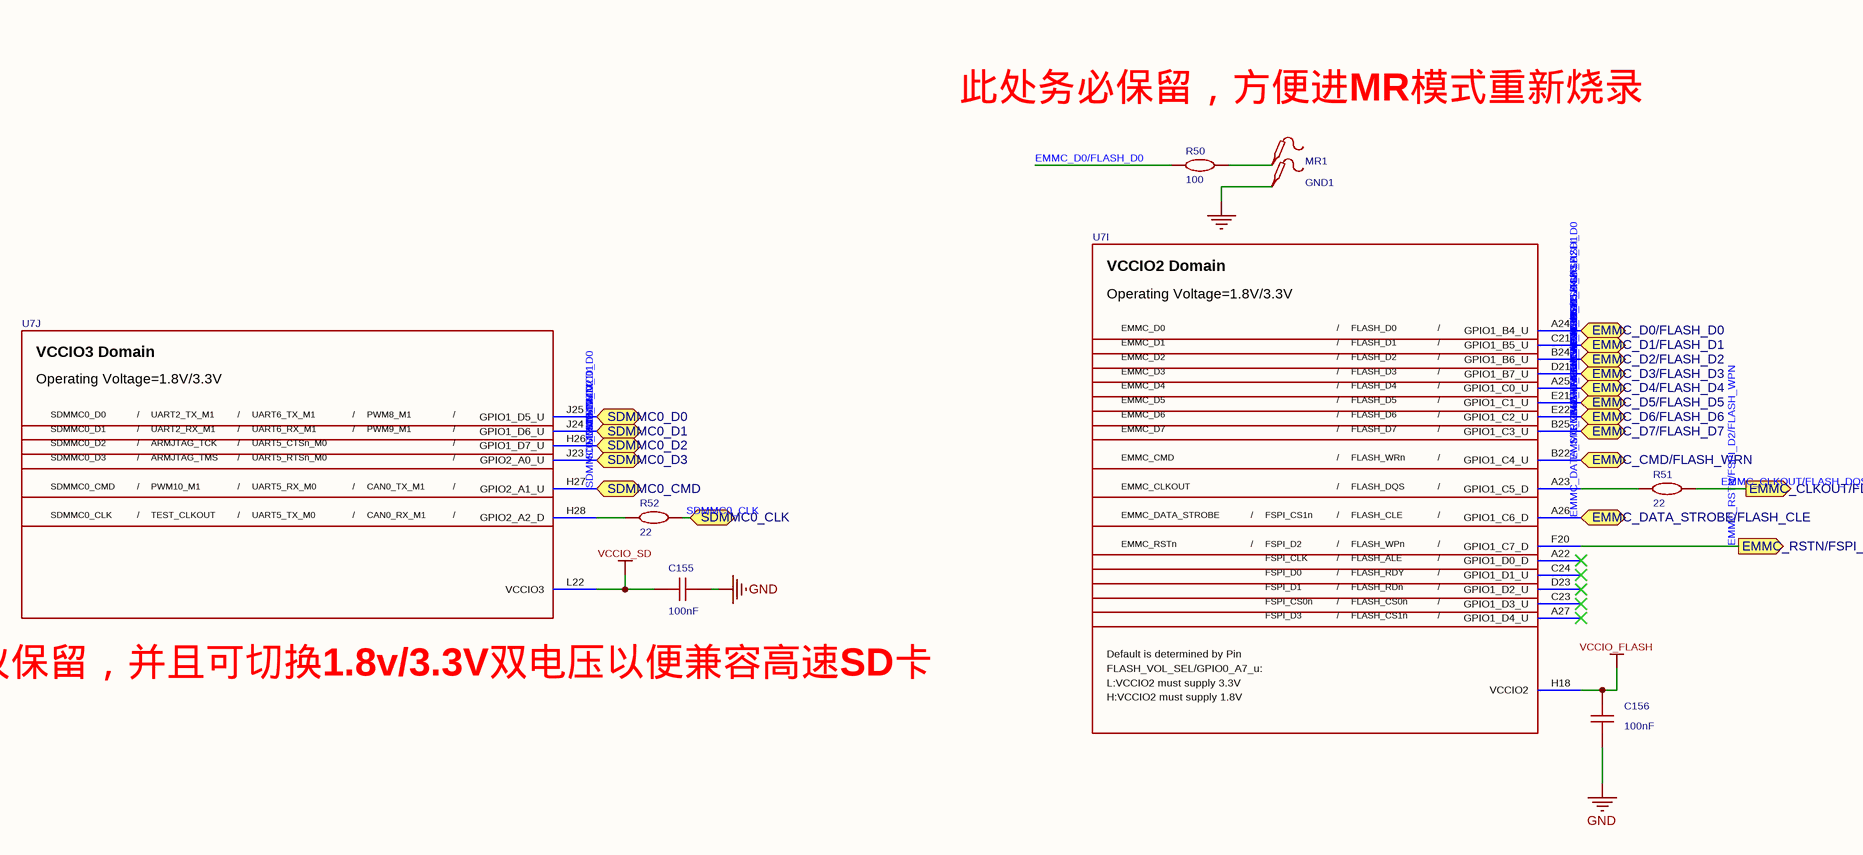
[diagram p12: SOC_FLASH.schdoc]

### Parts
C155  100nF  [C0201]
C156  100nF  [C0201]
GND1  (no value)  [Test-Point-0.5mm]
MR1  (no value)  [Test-Point-0.5mm]
R50  100  [R0402]
R51  22  [R0402]
R52  22  [R0402]
U7  RK3568  [BGA-636_L19.0-W19.0-P0.65-BL]  (value not drawn)  (parts I,J of 23)

### Ports
EMMC_CLKOUT/FLASH_DQS (out), EMMC_CMD/FLASH_WRN (bidir), EMMC_D0/FLASH_D0 (bidir), EMMC_D1/FLASH_D1 (bidir), EMMC_D2/FLASH_D2 (bidir), EMMC_D3/FLASH_D3 (bidir), EMMC_D4/FLASH_D4 (bidir), EMMC_D5/FLASH_D5 (bidir), EMMC_D6/FLASH_D6 (bidir), EMMC_D7/FLASH_D7 (bidir), EMMC_DATA_STROBE/FLASH_CLE (bidir), EMMC_RSTN/FSPI_D2/FLASH_WPN (out), SDMMC0_CLK (bidir), SDMMC0_CMD (bidir), SDMMC0_D0 (bidir), SDMMC0_D1 (bidir), SDMMC0_D2 (bidir), SDMMC0_D3 (bidir)

### Nets
GND: C155.1 C156.1 GND1.1
VCCIO_FLASH: C156.2 U7.H18(VCCIO2)
VCCIO_SD: C155.2 U7.L22(VCCIO3)
EMMC_CLKOUT/FLASH_DQS: R51.2 ; port EMMC_CLKOUT/FLASH_DQS
EMMC_CMD/FLASH_WRN: U7.B22(GPIO1_C4_U) ; port EMMC_CMD/FLASH_WRN
EMMC_D0/FLASH_D0: R50.1 U7.A24(GPIO1_B4_U) ; port EMMC_D0/FLASH_D0
EMMC_D1/FLASH_D1: U7.C21(GPIO1_B5_U) ; port EMMC_D1/FLASH_D1
EMMC_D2/FLASH_D2: U7.B24(GPIO1_B6_U) ; port EMMC_D2/FLASH_D2
EMMC_D3/FLASH_D3: U7.D21(GPIO1_B7_U) ; port EMMC_D3/FLASH_D3
EMMC_D4/FLASH_D4: U7.A25(GPIO1_C0_U) ; port EMMC_D4/FLASH_D4
EMMC_D5/FLASH_D5: U7.E21(GPIO1_C1_U) ; port EMMC_D5/FLASH_D5
EMMC_D6/FLASH_D6: U7.E22(GPIO1_C2_U) ; port EMMC_D6/FLASH_D6
EMMC_D7/FLASH_D7: U7.B25(GPIO1_C3_U) ; port EMMC_D7/FLASH_D7
EMMC_DATA_STROBE/FLASH_CLE: U7.A26(GPIO1_C6_D) ; port EMMC_DATA_STROBE/FLASH_CLE
EMMC_RSTN/FSPI_D2/FLASH_WPN: U7.F20(GPIO1_C7_D) ; port EMMC_RSTN/FSPI_D2/FLASH_WPN
SDMMC0_CLK: R52.2 ; port SDMMC0_CLK
SDMMC0_CMD: U7.H27(GPIO2_A1_U) ; port SDMMC0_CMD
SDMMC0_D0: U7.J25(GPIO1_D5_U) ; port SDMMC0_D0
SDMMC0_D1: U7.J24(GPIO1_D6_U) ; port SDMMC0_D1
SDMMC0_D2: U7.H26(GPIO1_D7_U) ; port SDMMC0_D2
SDMMC0_D3: U7.J23(GPIO2_A0_U) ; port SDMMC0_D3
NetMR1_1: MR1.1 R50.2
NetR51_1: R51.1 U7.A23(GPIO1_C5_D)
NetR52_1: R52.1 U7.H28(GPIO2_A2_D)

Not connected (* = marked no-connect by the designer): U7 A22(GPIO1_D0_D)* A27(GPIO1_D4_U)* C23(GPIO1_D3_U)* C24(GPIO1_D1_U)* D23(GPIO1_D2_U)*

### Notes on the sheet
- 此处务必保留，方便进MR模式重新烧录
- 此处建议保留，并且可切换1.8v/3.3V双电压以便兼容高速SD卡
- Drawn By :
- Checked By :
- Approved By :
- SheetNumber
- SheetTotal
- Revision :
- Time :
- Size :
- Date :
- A3
- DocumentName :
- Project :
- (in symbol RK3568, part I) VCCIO2 Domain; Operating Voltage=1.8V/3.3V; EMMC_D0; /; FLASH_D0; EMMC_D1; FLASH_D1; EMMC_D2; FLASH_D2; EMMC_D3; FLASH_D3; EMMC_D4; FLASH_D4; EMMC_D5; FLASH_D5; EMMC_D6; FLASH_D6; EMMC_D7; FLASH_D7; EMMC_CMD; FLASH_WRn; EMMC_CLKOUT; FLASH_DQS; EMMC_DATA_STROBE; FSPI_CS1n; FLASH_CLE; EMMC_RSTn; FSPI_D2; FLASH_WPn; FSPI_CLK; FLASH_ALE; FSPI_D0; FLASH_RDY; FSPI_D1; FLASH_RDn; FSPI_CS0n; FLASH_CS0n; FSPI_D3; FLASH_CS1n; Default is determined by Pin; FLASH_VOL_SEL/GPIO0_A7_u:; L:VCCIO2 must supply 3.3V; H:VCCIO2 must supply 1.8V
- (in symbol RK3568, part J) VCCIO3 Domain; Operating Voltage=1.8V/3.3V; SDMMC0_D0; /; UART2_TX_M1; UART6_TX_M1; PWM8_M1; SDMMC0_D1; UART2_RX_M1; UART6_RX_M1; PWM9_M1; SDMMC0_D2; ARMJTAG_TCK; UART5_CTSn_M0; SDMMC0_D3; ARMJTAG_TMS; UART5_RTSn_M0; SDMMC0_CMD; PWM10_M1; UART5_RX_M0; CAN0_TX_M1; SDMMC0_CLK; TEST_CLKOUT; UART5_TX_M0; CAN0_RX_M1

### Library data of the parts
C155 C156 = GRM035R60J475ME15D: as C124-C131 on sheet SOC_COMPHY_USB; Symbol: GRM035R60J475ME15D; Value: 100nF; Device: GRM035R60J475ME15D; LCSC Part Name: 4.7uF ±20% 6.3V; ManufacturerPart: GRM035R60J475ME15D; Supplier Footprint: 0201; JLCPCB Part Class: Extended Part; Datasheet: https://item.szlcsc.com/datasheet/GRM035R60J475ME15D/313624.html; Supplier: LCSC; ConvertToPcb: yes; FootprintName: C0201
GND1 MR1 = Test-Point: Test Point 测试点; AddInBom: yes; Device: Test-Point; ConvertToPcb: yes; SymbolName: Test-Point; FootprintName: Test-Point-0.5mm
R50 = Res_0402: Symbol: 电阻; ConvertToPcb: yes; ModelId: 671aefced39d4c318694bba8bd8efd39; ModelName: R0402_L1.0-W0.5-H0.5; ModelTransform: 39.37,19.685,0,0,0,0,0,0.0005,0; Value: 100; Device: Res_0402; AddInBom: yes; Supplier Footprint: 0402; FootprintName: R0402
R51 R52 = Res_0402: Symbol: 电阻; 3D Model: 671aefced39d4c318694bba8bd8efd39; 3D Model Transform: 39.37,19.685,0,0,0,0,0,0.0005,0; ConvertToPcb: yes; ModelName: R0402_L1.0-W0.5-H0.5; Device: Res_0402; Supplier Footprint: 0402; Value: 22; AddInBom: yes; FootprintName: R0402
U7 = RK3568: as U7 on sheet SOC_COMPHY_USB; Symbol: RK3568; Device: RK3568; AddInBom: yes; FootprintName: BGA-636_L19.0-W19.0-P0.65-BL; ModelName: BGA-636_L19.0-W19.0-P0.65-BL

## Sheet SOC_IO.schdoc: =
size A3; Symbol: Sheet-Symbol_A4; Company: 嘉立创EDA; Version: V1.0; Page Size: A4; @Project Name: RK3568B2地瓜派; @Page Count: 27; @Update Date: 2025-09-11; @Create Date: 2025-09-11; @Schematic Name: Schematic1; @Page No: 12; @Page Name: SOC_IO; Device: Sheet-Symbol_A4; Border: 1; Title Block Position: 3; Width: 1655; Height: 1170; Region Start: 1; X Region Count: 6; Y Region Count: 4; Blade Width: 10; @Board Name: Board1; @Create Time: 22:14:45; @Update Time: 22:15:05; Organization: ORGANIZATION; Address1: ADDRESS 1; Address2: ADDRESS 2; Address3: ADDRESS 3; Address4: ADDRESS 4; Revision: V1.0.0; SheetNumber: 14; SheetTotal: 28
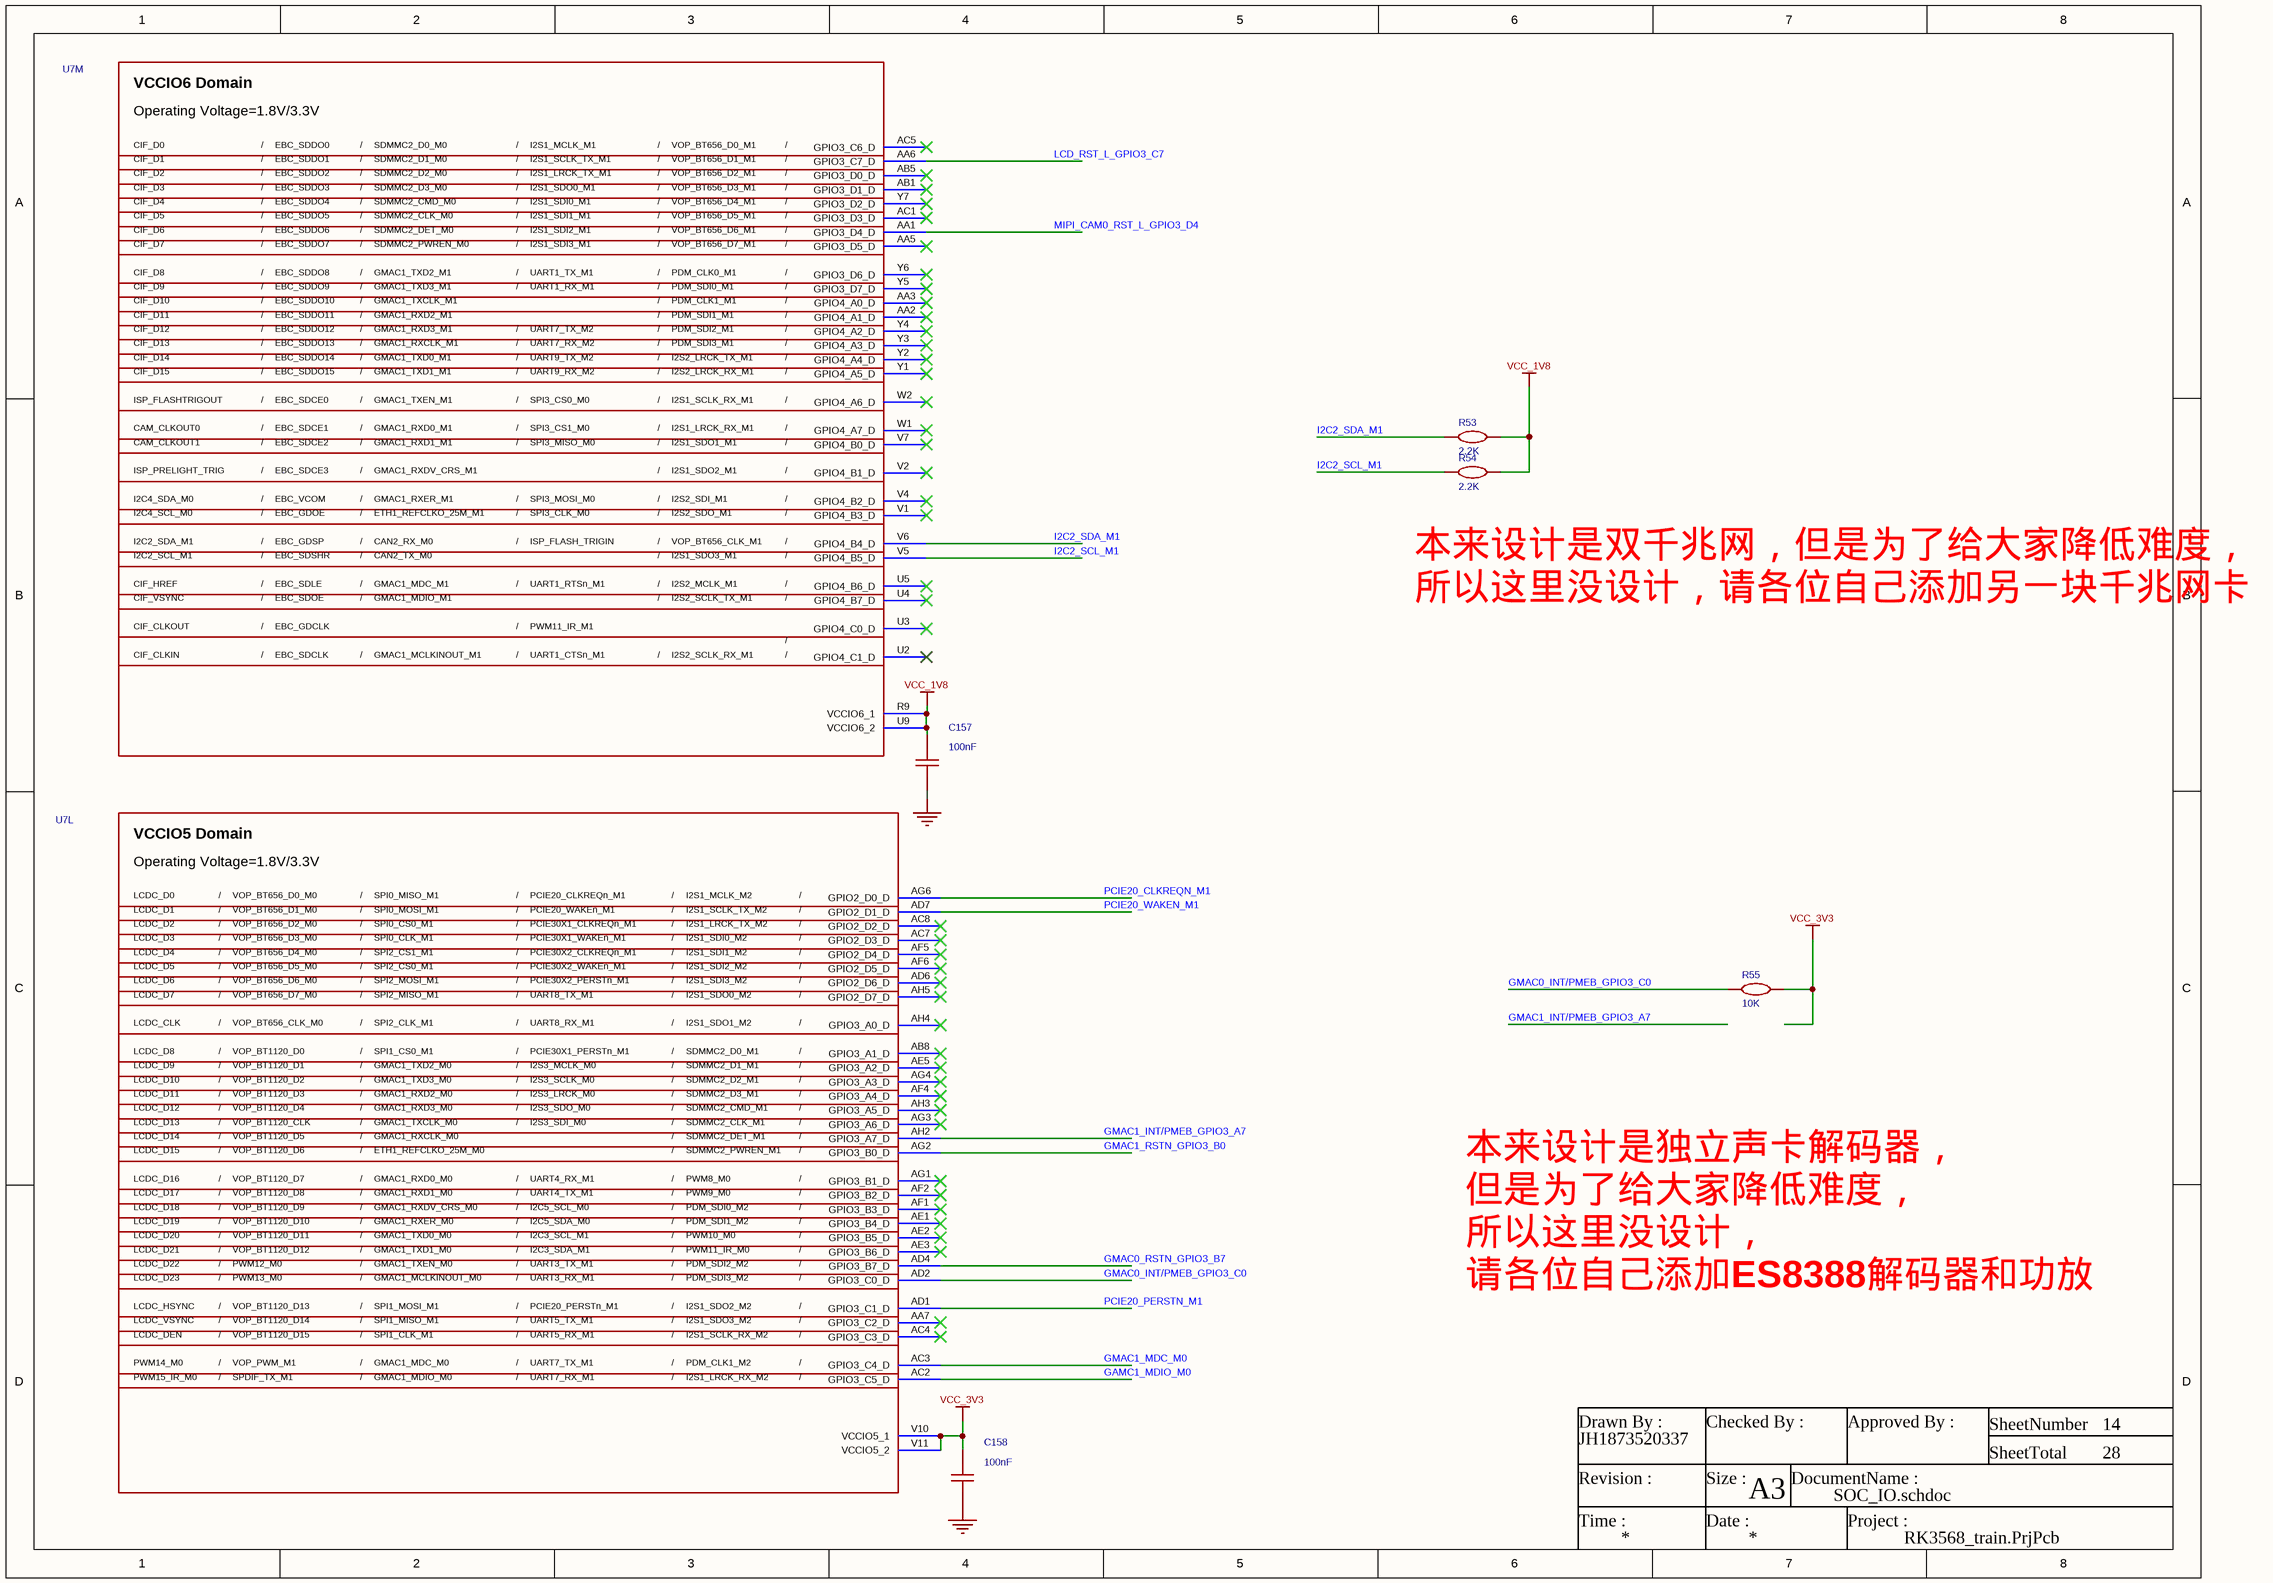
[diagram p13: SOC_IO.schdoc]

### Parts
C157  100nF  [C0201]
C158  100nF  [C0201]
R53  2.2K  [R0402]
R54  2.2K  [R0402]
R55  10K  [R0402]
U7  RK3568  [BGA-636_L19.0-W19.0-P0.65-BL]  (value not drawn)  (parts L,M of 23)

### Nets
GND: C157.1 C158.1
VCC_1V8: C157.2 R53.2 R54.2 U7.R9(VCCIO6_1) U7.U9(VCCIO6_2)  [project net LCD_1V8]
VCC_3V3: C158.2 R55.2 U7.V10(VCCIO5_1) U7.V11(VCCIO5_2)  [project net TP_3V3]
GAMC1_MDIO_M0: U7.AC2(GPIO3_C5_D)
GMAC0_INT/PMEB_GPIO3_C0: R55.1 U7.AD2(GPIO3_C0_D)
GMAC0_RSTN_GPIO3_B7: U7.AD4(GPIO3_B7_D)
GMAC1_INT/PMEB_GPIO3_A7: U7.AH2(GPIO3_A7_D)
GMAC1_MDC_M0: U7.AC3(GPIO3_C4_D)
GMAC1_RSTN_GPIO3_B0: U7.AG2(GPIO3_B0_D)
I2C2_SCL_M1: R54.1 U7.V5(GPIO4_B5_D)  [project net CAM_SCL]
I2C2_SDA_M1: R53.1 U7.V6(GPIO4_B4_D)  [project net CAM_SDA]
LCD_RST_L_GPIO3_C7: U7.AA6(GPIO3_C7_D)  [project net LCD_RST]
MIPI_CAM0_RST_L_GPIO3_D4: U7.AA1(GPIO3_D4_D)  [project net CAM0_GPIO]
PCIE20_CLKREQN_M1: U7.AG6(GPIO2_D0_D)
PCIE20_PERSTN_M1: U7.AD1(GPIO3_C1_D)
PCIE20_WAKEN_M1: U7.AD7(GPIO2_D1_D)

Not connected (* = marked no-connect by the designer): U7 AA2(GPIO4_A1_D)* AA3(GPIO4_A0_D)* AA5(GPIO3_D5_D)* AA7(GPIO3_C2_D)* AB1(GPIO3_D1_D)* AB5(GPIO3_D0_D)* AB8(GPIO3_A1_D)* AC1(GPIO3_D3_D)* AC4(GPIO3_C3_D)* AC5(GPIO3_C6_D)* AC7(GPIO2_D3_D)* AC8(GPIO2_D2_D)* AD6(GPIO2_D6_D)* AE1(GPIO3_B4_D)* AE2(GPIO3_B5_D)* AE3(GPIO3_B6_D)* AE5(GPIO3_A2_D)* AF1(GPIO3_B3_D)* AF2(GPIO3_B2_D)* AF4(GPIO3_A4_D)* AF5(GPIO2_D4_D)* AF6(GPIO2_D5_D)* AG1(GPIO3_B1_D)* AG3(GPIO3_A6_D)* AG4(GPIO3_A3_D)* AH3(GPIO3_A5_D)* AH4(GPIO3_A0_D)* AH5(GPIO2_D7_D)* U2(GPIO4_C1_D)* U3(GPIO4_C0_D)* U4(GPIO4_B7_D)* U5(GPIO4_B6_D)* V1(GPIO4_B3_D)* V2(GPIO4_B1_D)* V4(GPIO4_B2_D)* V7(GPIO4_B0_D)* W1(GPIO4_A7_D)* W2(GPIO4_A6_D)* Y1(GPIO4_A5_D)* Y2(GPIO4_A4_D)* Y3(GPIO4_A3_D)* Y4(GPIO4_A2_D)* Y5(GPIO3_D7_D)* Y6(GPIO3_D6_D)* Y7(GPIO3_D2_D)*

### Notes on the sheet
- 本来设计是双千兆网，但是为了给大家降低难度，
  所以这里没设计，请各位自己添加另一块千兆网卡
- 本来设计是独立声卡解码器，
  但是为了给大家降低难度，
  所以这里没设计，
  请各位自己添加ES8388解码器和功放
- Drawn By :
- Checked By :
- Approved By :
- SheetNumber
- SheetTotal
- Revision :
- Time :
- Size :
- Date :
- A3
- DocumentName :
- Project :
- (in symbol RK3568, part L) VCCIO5 Domain; Operating Voltage=1.8V/3.3V; LCDC_D0; /; VOP_BT656_D0_M0; SPI0_MISO_M1; PCIE20_CLKREQn_M1; I2S1_MCLK_M2; LCDC_D1; VOP_BT656_D1_M0; SPI0_MOSI_M1; PCIE20_WAKEn_M1; I2S1_SCLK_TX_M2; LCDC_D2; VOP_BT656_D2_M0; SPI0_CS0_M1; PCIE30X1_CLKREQn_M1; I2S1_LRCK_TX_M2; LCDC_D3; VOP_BT656_D3_M0; SPI0_CLK_M1; PCIE30X1_WAKEn_M1; I2S1_SDI0_M2; LCDC_D4; VOP_BT656_D4_M0; SPI2_CS1_M1; PCIE30X2_CLKREQn_M1; I2S1_SDI1_M2; LCDC_D5; VOP_BT656_D5_M0; SPI2_CS0_M1; PCIE30X2_WAKEn_M1; I2S1_SDI2_M2; LCDC_D6; VOP_BT656_D6_M0; SPI2_MOSI_M1; PCIE30X2_PERSTn_M1; I2S1_SDI3_M2; LCDC_D7; VOP_BT656_D7_M0; SPI2_MISO_M1; UART8_TX_M1; I2S1_SDO0_M2; LCDC_CLK; VOP_BT656_CLK_M0; SPI2_CLK_M1; UART8_RX_M1; I2S1_SDO1_M2; LCDC_D8; VOP_BT1120_D0; SPI1_CS0_M1; PCIE30X1_PERSTn_M1; SDMMC2_D0_M1; LCDC_D9; VOP_BT1120_D1; GMAC1_TXD2_M0; I2S3_MCLK_M0; SDMMC2_D1_M1; LCDC_D10; VOP_BT1120_D2; GMAC1_TXD3_M0; I2S3_SCLK_M0; SDMMC2_D2_M1; LCDC_D11; VOP_BT1120_D3; GMAC1_RXD2_M0; I2S3_LRCK_M0; SDMMC2_D3_M1; LCDC_D12; VOP_BT1120_D4; GMAC1_RXD3_M0; I2S3_SDO_M0; SDMMC2_CMD_M1; LCDC_D13; VOP_BT1120_CLK; GMAC1_TXCLK_M0; I2S3_SDI_M0; SDMMC2_CLK_M1; LCDC_D14; VOP_BT1120_D5; GMAC1_RXCLK_M0; SDMMC2_DET_M1; LCDC_D15; VOP_BT1120_D6; ETH1_REFCLKO_25M_M0; SDMMC2_PWREN_M1; LCDC_D16; VOP_BT1120_D7; GMAC1_RXD0_M0; UART4_RX_M1; PWM8_M0; LCDC_D17; VOP_BT1120_D8; GMAC1_RXD1_M0; UART4_TX_M1; PWM9_M0; LCDC_D18; VOP_BT1120_D9; GMAC1_RXDV_CRS_M0; I2C5_SCL_M0; PDM_SDI0_M2; LCDC_D19; VOP_BT1120_D10; GMAC1_RXER_M0; I2C5_SDA_M0; PDM_SDI1_M2; LCDC_D20; VOP_BT1120_D11; GMAC1_TXD0_M0; I2C3_SCL_M1; PWM10_M0; LCDC_D21; VOP_BT1120_D12; GMAC1_TXD1_M0; I2C3_SDA_M1; PWM11_IR_M0; LCDC_D22; PWM12_M0; GMAC1_TXEN_M0; UART3_TX_M1; PDM_SDI2_M2; LCDC_D23; PWM13_M0; GMAC1_MCLKINOUT_M0; UART3_RX_M1; PDM_SDI3_M2; LCDC_HSYNC; VOP_BT1120_D13; SPI1_MOSI_M1; PCIE20_PERSTn_M1; I2S1_SDO2_M2; LCDC_VSYNC; VOP_BT1120_D14; SPI1_MISO_M1; UART5_TX_M1; I2S1_SDO3_M2; LCDC_DEN; VOP_BT1120_D15; SPI1_CLK_M1; UART5_RX_M1; I2S1_SCLK_RX_M2; PWM14_M0; VOP_PWM_M1; GMAC1_MDC_M0; UART7_TX_M1; PDM_CLK1_M2; PWM15_IR_M0; SPDIF_TX_M1; GMAC1_MDIO_M0; UART7_RX_M1; I2S1_LRCK_RX_M2
- (in symbol RK3568, part M) VCCIO6 Domain; Operating Voltage=1.8V/3.3V; CIF_D0; /; EBC_SDDO0; SDMMC2_D0_M0; I2S1_MCLK_M1; VOP_BT656_D0_M1; CIF_D1; EBC_SDDO1; SDMMC2_D1_M0; I2S1_SCLK_TX_M1; VOP_BT656_D1_M1; CIF_D2; EBC_SDDO2; SDMMC2_D2_M0; I2S1_LRCK_TX_M1; VOP_BT656_D2_M1; CIF_D3; EBC_SDDO3; SDMMC2_D3_M0; I2S1_SDO0_M1; VOP_BT656_D3_M1; CIF_D4; EBC_SDDO4; SDMMC2_CMD_M0; I2S1_SDI0_M1; VOP_BT656_D4_M1; CIF_D5; EBC_SDDO5; SDMMC2_CLK_M0; I2S1_SDI1_M1; VOP_BT656_D5_M1; CIF_D6; EBC_SDDO6; SDMMC2_DET_M0; I2S1_SDI2_M1; VOP_BT656_D6_M1; CIF_D7; EBC_SDDO7; SDMMC2_PWREN_M0; I2S1_SDI3_M1; VOP_BT656_D7_M1; CIF_D8; EBC_SDDO8; GMAC1_TXD2_M1; UART1_TX_M1; PDM_CLK0_M1; CIF_D9; EBC_SDDO9; GMAC1_TXD3_M1; UART1_RX_M1; PDM_SDI0_M1; CIF_D10; EBC_SDDO10; GMAC1_TXCLK_M1; PDM_CLK1_M1; CIF_D11; EBC_SDDO11; GMAC1_RXD2_M1; PDM_SDI1_M1; CIF_D12; EBC_SDDO12; GMAC1_RXD3_M1; UART7_TX_M2; PDM_SDI2_M1; CIF_D13; EBC_SDDO13; GMAC1_RXCLK_M1; UART7_RX_M2; PDM_SDI3_M1; CIF_D14; EBC_SDDO14; GMAC1_TXD0_M1; UART9_TX_M2; I2S2_LRCK_TX_M1; CIF_D15; EBC_SDDO15; GMAC1_TXD1_M1; UART9_RX_M2; I2S2_LRCK_RX_M1; ISP_FLASHTRIGOUT; EBC_SDCE0; GMAC1_TXEN_M1; SPI3_CS0_M0; I2S1_SCLK_RX_M1; CAM_CLKOUT0; EBC_SDCE1; GMAC1_RXD0_M1; SPI3_CS1_M0; I2S1_LRCK_RX_M1; CAM_CLKOUT1; EBC_SDCE2; GMAC1_RXD1_M1; SPI3_MISO_M0; I2S1_SDO1_M1; ISP_PRELIGHT_TRIG; EBC_SDCE3; GMAC1_RXDV_CRS_M1; I2S1_SDO2_M1; I2C4_SDA_M0; EBC_VCOM; GMAC1_RXER_M1; SPI3_MOSI_M0; I2S2_SDI_M1; I2C4_SCL_M0; EBC_GDOE; ETH1_REFCLKO_25M_M1; SPI3_CLK_M0; I2S2_SDO_M1; I2C2_SDA_M1; EBC_GDSP; CAN2_RX_M0; ISP_FLASH_TRIGIN; VOP_BT656_CLK_M1; I2C2_SCL_M1; EBC_SDSHR; CAN2_TX_M0; I2S1_SDO3_M1; CIF_HREF; EBC_SDLE; GMAC1_MDC_M1; UART1_RTSn_M1; I2S2_MCLK_M1; CIF_VSYNC; EBC_SDOE; GMAC1_MDIO_M1; I2S2_SCLK_TX_M1; CIF_CLKOUT; EBC_GDCLK; PWM11_IR_M1; CIF_CLKIN; EBC_SDCLK; GMAC1_MCLKINOUT_M1; UART1_CTSn_M1; I2S2_SCLK_RX_M1

### Library data of the parts
C157 C158 = GRM035R60J475ME15D: as C124-C131 on sheet SOC_COMPHY_USB; Symbol: GRM035R60J475ME15D; Value: 100nF; Device: GRM035R60J475ME15D; LCSC Part Name: 4.7uF ±20% 6.3V; ManufacturerPart: GRM035R60J475ME15D; Supplier Footprint: 0201; JLCPCB Part Class: Extended Part; Datasheet: https://item.szlcsc.com/datasheet/GRM035R60J475ME15D/313624.html; Supplier: LCSC; ConvertToPcb: yes; FootprintName: C0201
R53-R55 = Res_0402: as R50 on sheet SOC_FLASH; Device: Res_0402; AddInBom: yes; Supplier Footprint: 0402; FootprintName: R0402
  R53 R54: Value: 2.2K
  R55: Value: 10K
U7 = RK3568: as U7 on sheet SOC_COMPHY_USB; Symbol: RK3568; Device: RK3568; AddInBom: yes; FootprintName: BGA-636_L19.0-W19.0-P0.65-BL; ModelName: BGA-636_L19.0-W19.0-P0.65-BL

## Sheet SOC_MAC_SAR_I2S.schdoc: =
size A3; Symbol: Sheet-Symbol_A4; Company: 嘉立创EDA; Version: V1.0; Page Size: A4; @Project Name: RK3568_LPD4X_120P_Core; @Page Count: 18; @Update Date: 2025-08-22; @Create Date: 2025-08-15; @Schematic Name: Schematic1; @Page No: 9; @Page Name: SOC_MAC/SAR/I2S; Device: Sheet-Symbol_A4; Border: 1; Title Block Position: 3; Width: 1655; Height: 1170; Region Start: 1; X Region Count: 6; Y Region Count: 4; Blade Width: 10; @Board Name: Board1; @Create Time: 14:20:47; @Update Time: 20:07:26; Organization: ORGANIZATION; Address1: ADDRESS 1; Address2: ADDRESS 2; Address3: ADDRESS 3; Address4: ADDRESS 4; Revision: V1.0.0; SheetNumber: 15; SheetTotal: 28
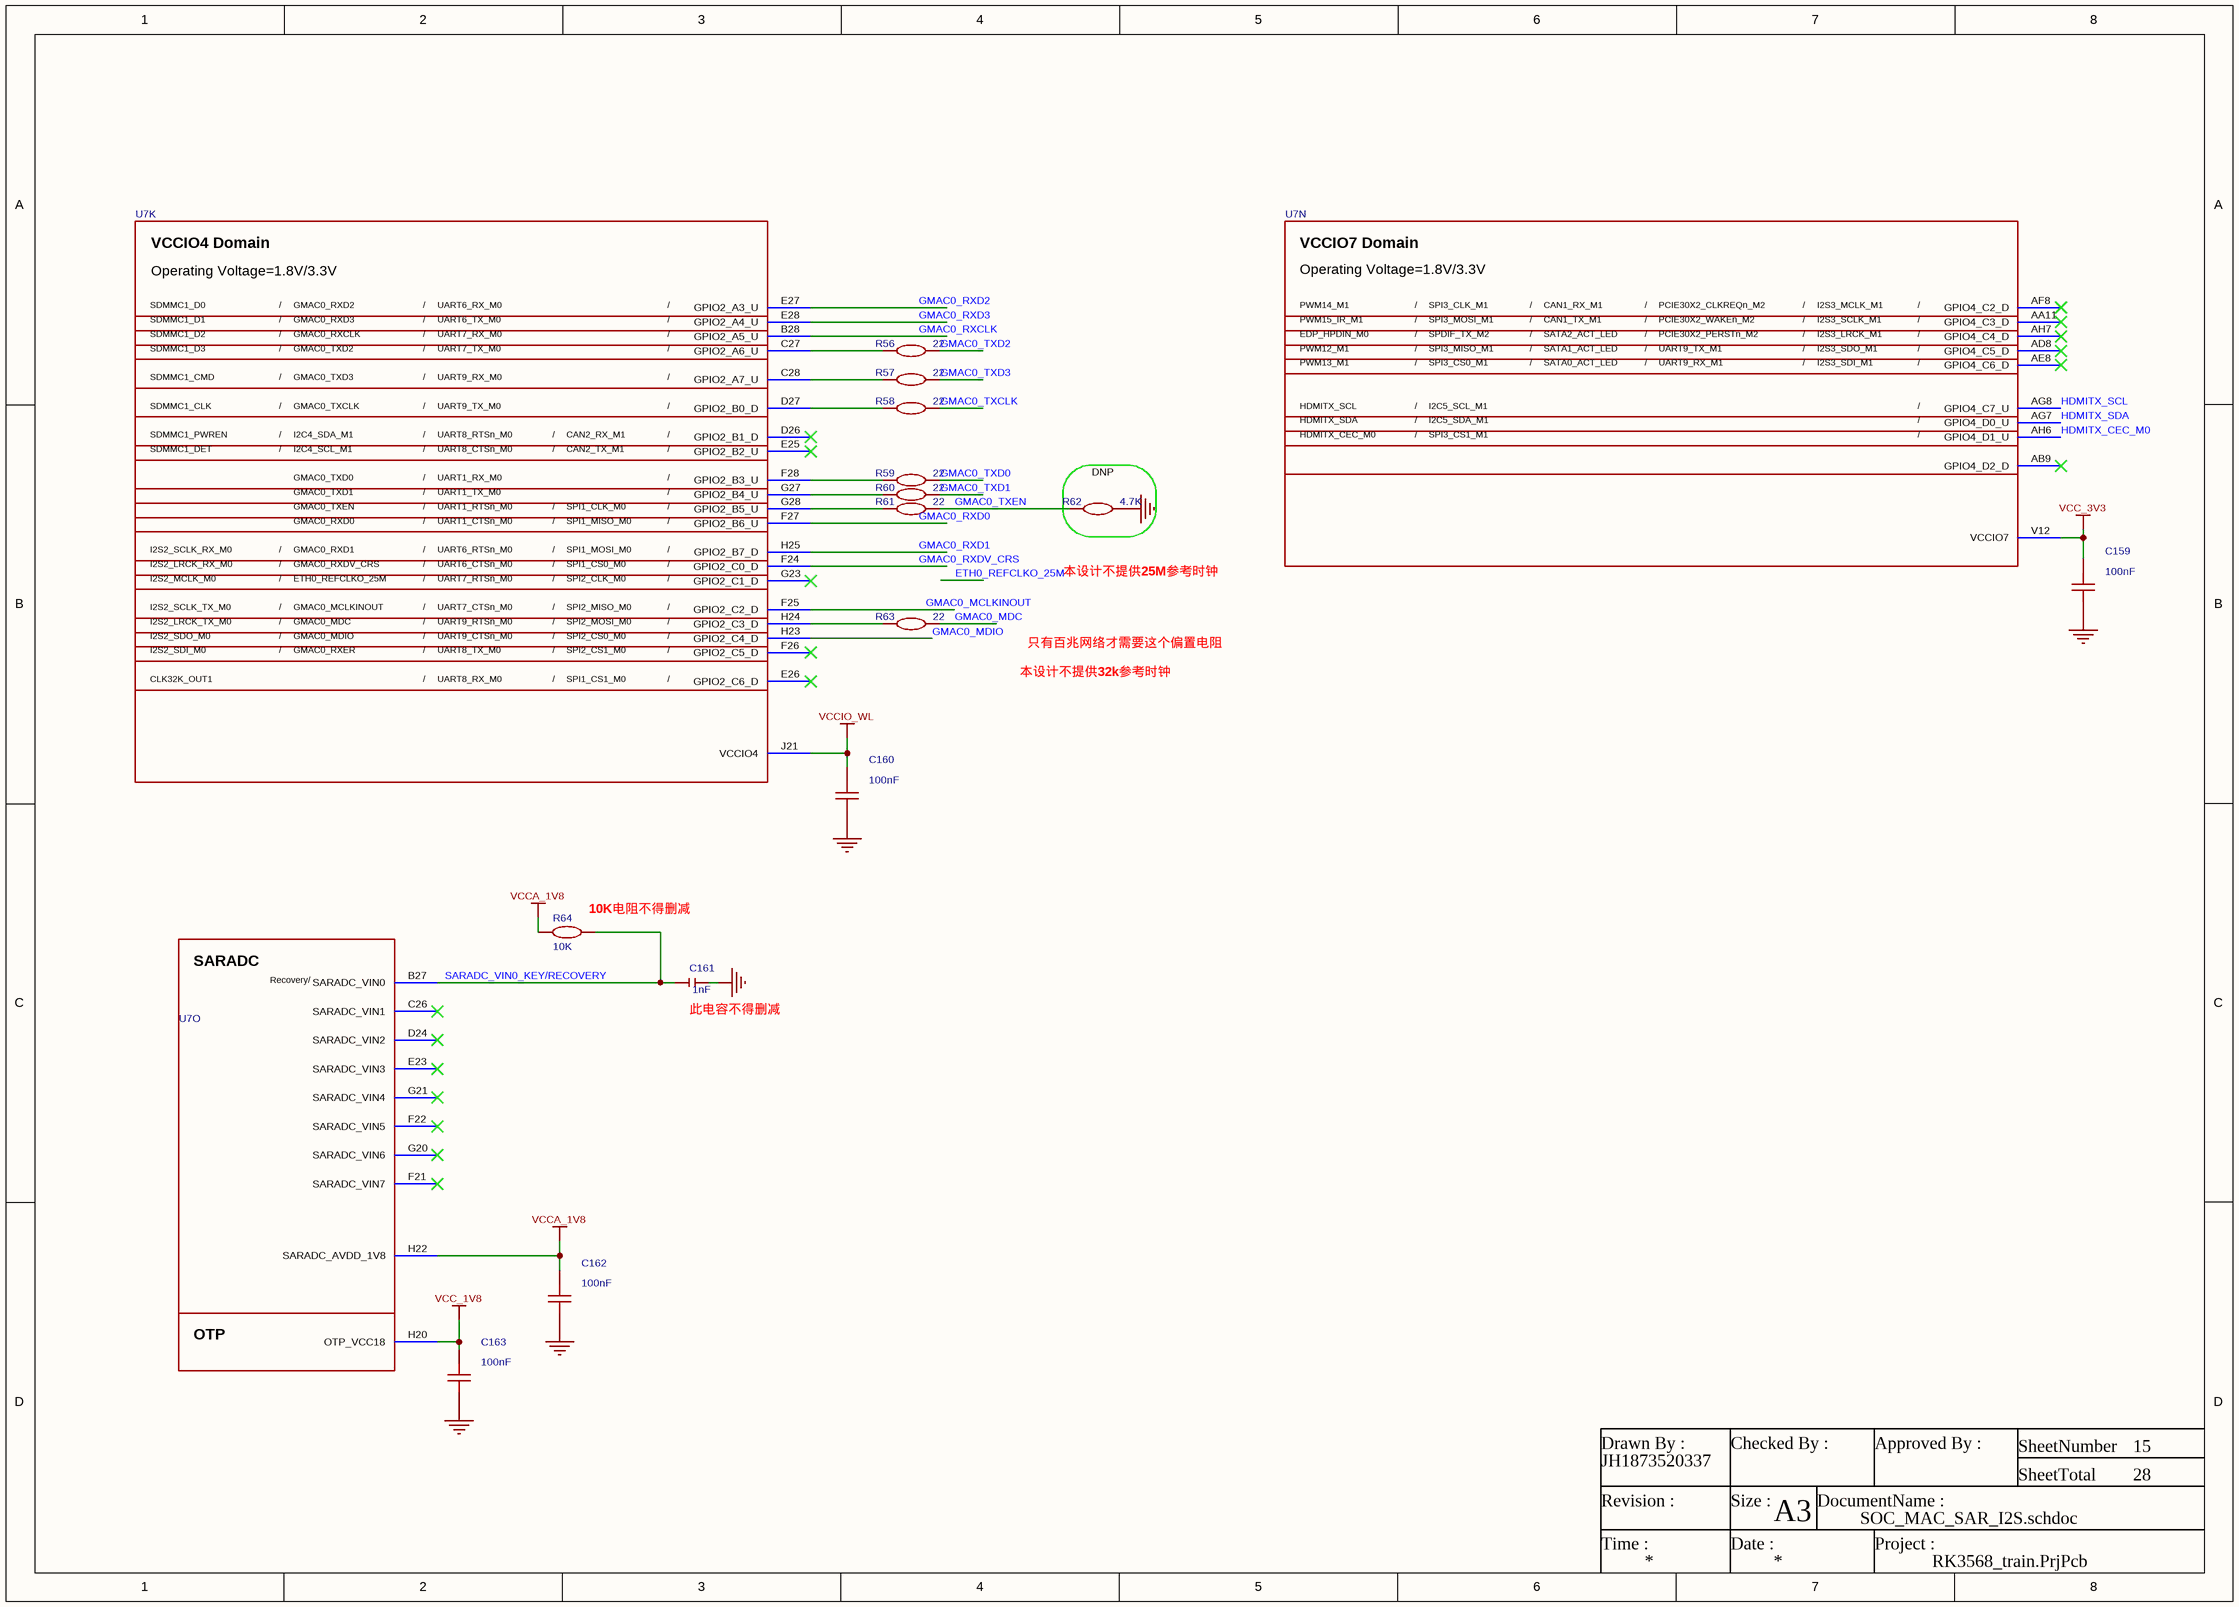
[diagram p14: SOC_MAC_SAR_I2S.schdoc]

### Parts
C159  100nF  [C0201]
C160  100nF  [C0201]
C161  1nF  [MYC0402]
C162  100nF  [C0201]
C163  100nF  [C0201]
R56  22  [R0402]
R57  22  [R0402]
R58  22  [R0402]
R59  22  [R0402]
R60  22  [R0402]
R61  22  [R0402]
R62  4.7K  [R0402]  (no BOM)
R63  22  [R0402]
R64  10K  [R0402]
U7  RK3568  [BGA-636_L19.0-W19.0-P0.65-BL]  (value not drawn)  (parts K,N,O of 23)

### Blocks framed on the sheet
DNP: R62

### Nets
GND: C159.1 C160.1 C161.2 C162.1 C163.1 R62.2
VCC_1V8: C163.2 U7.H20(OTP_VCC18)  [project net LCD_1V8]
VCC_3V3: C159.2 U7.V12(VCCIO7)  [project net TP_3V3]
VCCA_1V8: C162.2 R64.1 U7.H22(SARADC_AVDD_1V8)
VCCIO_WL: C160.2 U7.J21(VCCIO4)
GMAC0_MCLKINOUT: U7.F25(GPIO2_C2_D)
GMAC0_MDC: R63.2
GMAC0_MDIO: U7.H23(GPIO2_C4_D)
GMAC0_RXCLK: U7.B28(GPIO2_A5_U)
GMAC0_RXD0: U7.F27(GPIO2_B6_U)
GMAC0_RXD1: U7.H25(GPIO2_B7_D)
GMAC0_RXD2: U7.E27(GPIO2_A3_U)
GMAC0_RXD3: U7.E28(GPIO2_A4_U)
GMAC0_RXDV_CRS: U7.F24(GPIO2_C0_D)
GMAC0_TXCLK: R58.2
GMAC0_TXD0: R59.2
GMAC0_TXD1: R60.2
GMAC0_TXD2: R56.2
GMAC0_TXD3: R57.2
GMAC0_TXEN: R61.2 R62.1
HDMITX_CEC_M0: U7.AH6(GPIO4_D1_U)
HDMITX_SCL: U7.AG8(GPIO4_C7_U)
HDMITX_SDA: U7.AG7(GPIO4_D0_U)
SARADC_VIN0_KEY/RECOVERY: C161.1 R64.2 U7.B27(SARADC_VIN0)
NetR56_1: R56.1 U7.C27(GPIO2_A6_U)
NetR57_1: R57.1 U7.C28(GPIO2_A7_U)
NetR58_1: R58.1 U7.D27(GPIO2_B0_D)
NetR59_1: R59.1 U7.F28(GPIO2_B3_U)
NetR60_1: R60.1 U7.G27(GPIO2_B4_U)
NetR61_1: R61.1 U7.G28(GPIO2_B5_U)
NetR63_1: R63.1 U7.H24(GPIO2_C3_D)

Not connected (* = marked no-connect by the designer): U7 AA11(GPIO4_C3_D)* AB9(GPIO4_D2_D)* AD8(GPIO4_C5_D)* AE8(GPIO4_C6_D)* AF8(GPIO4_C2_D)* AH7(GPIO4_C4_D)* C26(SARADC_VIN1)* D24(SARADC_VIN2)* D26(GPIO2_B1_D)* E23(SARADC_VIN3)* E25(GPIO2_B2_U)* E26(GPIO2_C6_D)* F21(SARADC_VIN7)* F22(SARADC_VIN5)* F26(GPIO2_C5_D)* G20(SARADC_VIN6)* G21(SARADC_VIN4)* G23(GPIO2_C1_D)*

### Notes on the sheet
- (near R62) 本设计不提供25M参考时钟
- 本设计不提供32k参考时钟
- 只有百兆网络才需要这个偏置电阻
- (near R64) 10K电阻不得删减
- (near C161) 此电容不得删减
- Drawn By :
- Checked By :
- Approved By :
- SheetNumber
- SheetTotal
- Revision :
- Time :
- Size :
- Date :
- A3
- DocumentName :
- Project :
- (in symbol RK3568, part K) VCCIO4 Domain; Operating Voltage=1.8V/3.3V; SDMMC1_D0; /; GMAC0_RXD2; UART6_RX_M0; SDMMC1_D1; GMAC0_RXD3; UART6_TX_M0; SDMMC1_D2; GMAC0_RXCLK; UART7_RX_M0; SDMMC1_D3; GMAC0_TXD2; UART7_TX_M0; SDMMC1_CMD; GMAC0_TXD3; UART9_RX_M0; SDMMC1_CLK; GMAC0_TXCLK; UART9_TX_M0; SDMMC1_PWREN; I2C4_SDA_M1; UART8_RTSn_M0; CAN2_RX_M1; SDMMC1_DET; I2C4_SCL_M1; UART8_CTSn_M0; CAN2_TX_M1; GMAC0_TXD0; UART1_RX_M0; GMAC0_TXD1; UART1_TX_M0; GMAC0_TXEN; UART1_RTSn_M0; SPI1_CLK_M0; GMAC0_RXD0; UART1_CTSn_M0; SPI1_MISO_M0; I2S2_SCLK_RX_M0; GMAC0_RXD1; UART6_RTSn_M0; SPI1_MOSI_M0; I2S2_LRCK_RX_M0; GMAC0_RXDV_CRS; UART6_CTSn_M0; SPI1_CS0_M0; I2S2_MCLK_M0; ETH0_REFCLKO_25M; UART7_RTSn_M0; SPI2_CLK_M0; I2S2_SCLK_TX_M0; GMAC0_MCLKINOUT; UART7_CTSn_M0; SPI2_MISO_M0; I2S2_LRCK_TX_M0; GMAC0_MDC; UART9_RTSn_M0; SPI2_MOSI_M0; I2S2_SDO_M0; GMAC0_MDIO; UART9_CTSn_M0; SPI2_CS0_M0; I2S2_SDI_M0; GMAC0_RXER; UART8_TX_M0; SPI2_CS1_M0; CLK32K_OUT1; UART8_RX_M0; SPI1_CS1_M0
- (in symbol RK3568, part N) VCCIO7 Domain; Operating Voltage=1.8V/3.3V; PWM14_M1; /; SPI3_CLK_M1; CAN1_RX_M1; PCIE30X2_CLKREQn_M2; I2S3_MCLK_M1; PWM15_IR_M1; SPI3_MOSI_M1; CAN1_TX_M1; PCIE30X2_WAKEn_M2; I2S3_SCLK_M1; EDP_HPDIN_M0; SPDIF_TX_M2; SATA2_ACT_LED; PCIE30X2_PERSTn_M2; I2S3_LRCK_M1; PWM12_M1; SPI3_MISO_M1; SATA1_ACT_LED; UART9_TX_M1; I2S3_SDO_M1; PWM13_M1; SPI3_CS0_M1; SATA0_ACT_LED; UART9_RX_M1; I2S3_SDI_M1; HDMITX_SCL; I2C5_SCL_M1; HDMITX_SDA; I2C5_SDA_M1; HDMITX_CEC_M0; SPI3_CS1_M1
- (in symbol RK3568, part O) SARADC; Recovery/; OTP

### Library data of the parts
C159 C160 C162 C163 = GRM035R60J475ME15D: as C124-C131 on sheet SOC_COMPHY_USB; Symbol: GRM035R60J475ME15D; Value: 100nF; Device: GRM035R60J475ME15D; LCSC Part Name: 4.7uF ±20% 6.3V; ManufacturerPart: GRM035R60J475ME15D; Supplier Footprint: 0201; JLCPCB Part Class: Extended Part; Datasheet: https://item.szlcsc.com/datasheet/GRM035R60J475ME15D/313624.html; Supplier: LCSC; ConvertToPcb: yes; FootprintName: C0201
C161 = MYC0402: C0402电容; Symbol: MY_C0201; AddInBom: yes; Device: MYC0402; Value: 1nF; ConvertToPcb: yes; FootprintName: MYC0402
R56-R61 R63 R64 = Res_0402: as R51 on sheet SOC_FLASH; Device: Res_0402; Supplier Footprint: 0402; AddInBom: yes; FootprintName: R0402
  R56-R61 R63: Value: 22
  R64: Value: 10K
R62 = Res_0402: Symbol: 电阻; 3D Model: 671aefced39d4c318694bba8bd8efd39; 3D Model Transform: 39.37,19.685,0,0,0,0,0,0.0005,0; Add into BOM: no; ConvertToPcb: yes; ModelName: R0402_L1.0-W0.5-H0.5; Device: Res_0402; Supplier Footprint: 0402; Value: 4.7K; FootprintName: R0402
U7 = RK3568: as U7 on sheet SOC_COMPHY_USB; Symbol: RK3568; Device: RK3568; AddInBom: yes; FootprintName: BGA-636_L19.0-W19.0-P0.65-BL; ModelName: BGA-636_L19.0-W19.0-P0.65-BL

## Sheet SOC_SOUND.schdoc: =
size A4; Symbol: Sheet-Symbol_A4; Company: 嘉立创EDA; Version: V1.0; Page Size: A4; @Project Name: RK3568B2地瓜派; @Page Count: 27; @Update Date: 2025-09-11; @Create Date: 2025-09-11; @Schematic Name: Schematic1; @Page No: 13; @Page Name: SOC_SOUND; Device: Sheet-Symbol_A4; Border: 1; Title Block Position: 3; Width: 1170; Height: 825; Region Start: 1; X Region Count: 6; Y Region Count: 4; Blade Width: 10; @Board Name: Board1; @Create Time: 22:14:45; @Update Time: 22:15:05; Organization: ORGANIZATION; Address1: ADDRESS 1; Address2: ADDRESS 2; Address3: ADDRESS 3; Address4: ADDRESS 4; Revision: V1.0.0; SheetNumber: 16; SheetTotal: 28
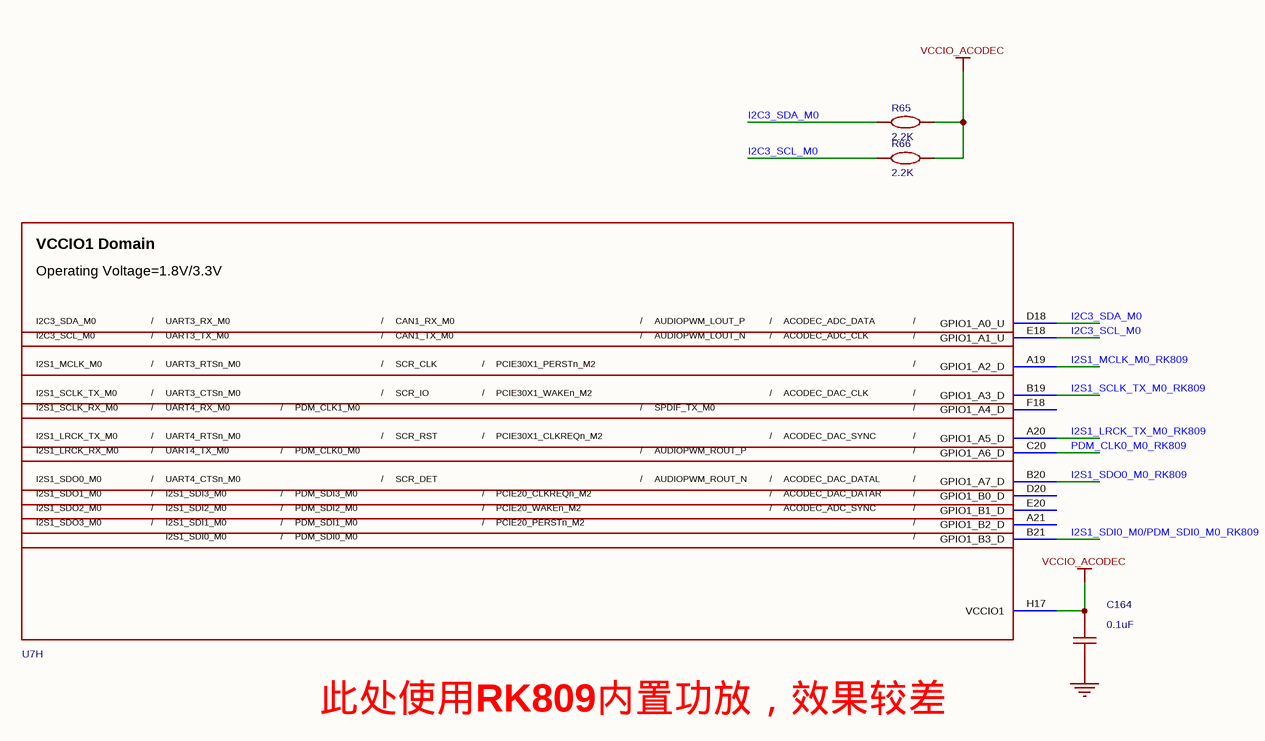
[diagram p15: SOC_SOUND.schdoc]

### Parts
C164  0.1uF  [C0201]
R65  2.2K  [R0402]
R66  2.2K  [R0402]
U7  RK3568  [BGA-636_L19.0-W19.0-P0.65-BL]  (value not drawn)  (part H of 23)

### Nets
GND: C164.1
VCCIO_ACODEC: C164.2 R65.2 R66.2 U7.H17(VCCIO1)
I2C3_SCL_M0: R66.1 U7.E18(GPIO1_A1_U)
I2C3_SDA_M0: R65.1 U7.D18(GPIO1_A0_U)
I2S1_LRCK_TX_M0_RK809: U7.A20(GPIO1_A5_D)
I2S1_MCLK_M0_RK809: U7.A19(GPIO1_A2_D)
I2S1_SCLK_TX_M0_RK809: U7.B19(GPIO1_A3_D)
I2S1_SDI0_M0/PDM_SDI0_M0_RK809: U7.B21(GPIO1_B3_D)
I2S1_SDO0_M0_RK809: U7.B20(GPIO1_A7_D)
PDM_CLK0_M0_RK809: U7.C20(GPIO1_A6_D)

Not connected (* = marked no-connect by the designer): U7 A21(GPIO1_B2_D) D20(GPIO1_B0_D) E20(GPIO1_B1_D) F18(GPIO1_A4_D)

### Notes on the sheet
- 此处使用RK809内置功放，效果较差
- Drawn By :
- Checked By :
- Approved By :
- SheetNumber
- SheetTotal
- Revision :
- Time :
- Size :
- Date :
- A4
- DocumentName :
- Project :
- (in symbol RK3568, part H) VCCIO1 Domain; Operating Voltage=1.8V/3.3V; I2C3_SDA_M0; /; UART3_RX_M0; CAN1_RX_M0; AUDIOPWM_LOUT_P; ACODEC_ADC_DATA; I2C3_SCL_M0; UART3_TX_M0; CAN1_TX_M0; AUDIOPWM_LOUT_N; ACODEC_ADC_CLK; I2S1_MCLK_M0; UART3_RTSn_M0; SCR_CLK; PCIE30X1_PERSTn_M2; I2S1_SCLK_TX_M0; UART3_CTSn_M0; SCR_IO; PCIE30X1_WAKEn_M2; ACODEC_DAC_CLK; I2S1_SCLK_RX_M0; UART4_RX_M0; PDM_CLK1_M0; SPDIF_TX_M0; I2S1_LRCK_TX_M0; UART4_RTSn_M0; SCR_RST; PCIE30X1_CLKREQn_M2; ACODEC_DAC_SYNC; I2S1_LRCK_RX_M0; UART4_TX_M0; PDM_CLK0_M0; AUDIOPWM_ROUT_P; I2S1_SDO0_M0; UART4_CTSn_M0; SCR_DET; AUDIOPWM_ROUT_N; ACODEC_DAC_DATAL; I2S1_SDO1_M0; I2S1_SDI3_M0; PDM_SDI3_M0; PCIE20_CLKREQn_M2; ACODEC_DAC_DATAR; I2S1_SDO2_M0; I2S1_SDI2_M0; PDM_SDI2_M0; PCIE20_WAKEn_M2; ACODEC_ADC_SYNC; I2S1_SDO3_M0; I2S1_SDI1_M0; PDM_SDI1_M0; PCIE20_PERSTn_M2; I2S1_SDI0_M0; PDM_SDI0_M0

### Library data of the parts
C164 = GRM035R60J475ME15D: as C124-C131 on sheet SOC_COMPHY_USB; Symbol: GRM035R60J475ME15D; Value: 0.1uF; Device: GRM035R60J475ME15D; LCSC Part Name: 4.7uF ±20% 6.3V; ManufacturerPart: GRM035R60J475ME15D; Supplier Footprint: 0201; JLCPCB Part Class: Extended Part; Datasheet: https://item.szlcsc.com/datasheet/GRM035R60J475ME15D/313624.html; Supplier: LCSC; ConvertToPcb: yes; FootprintName: C0201
R65 R66 = Res_0402: as R51 on sheet SOC_FLASH; Device: Res_0402; Supplier Footprint: 0402; Value: 2.2K; AddInBom: yes; FootprintName: R0402
U7 = RK3568: as U7 on sheet SOC_COMPHY_USB; Symbol: RK3568; Device: RK3568; AddInBom: yes; FootprintName: BGA-636_L19.0-W19.0-P0.65-BL; ModelName: BGA-636_L19.0-W19.0-P0.65-BL

## Sheet USB.schdoc: =
size A4; Symbol: Sheet-Symbol_A4; Company: 嘉立创EDA; Version: V1.0; Page Size: A4; @Project Name: RK3568B2地瓜派; @Page Count: 27; @Update Date: 2025-09-15; @Create Date: 2025-09-11; @Schematic Name: Schematic1; @Page No: 21; @Page Name: USB; Device: Sheet-Symbol_A4; Border: 1; Title Block Position: 3; Width: 1170; Height: 825; Region Start: 1; X Region Count: 6; Y Region Count: 4; Blade Width: 10; @Board Name: Board1; @Create Time: 22:22:48; @Update Time: 14:48:17; Organization: ORGANIZATION; Address1: ADDRESS 1; Address2: ADDRESS 2; Address3: ADDRESS 3; Address4: ADDRESS 4; Revision: V1.0.0; SheetNumber: 17; SheetTotal: 28
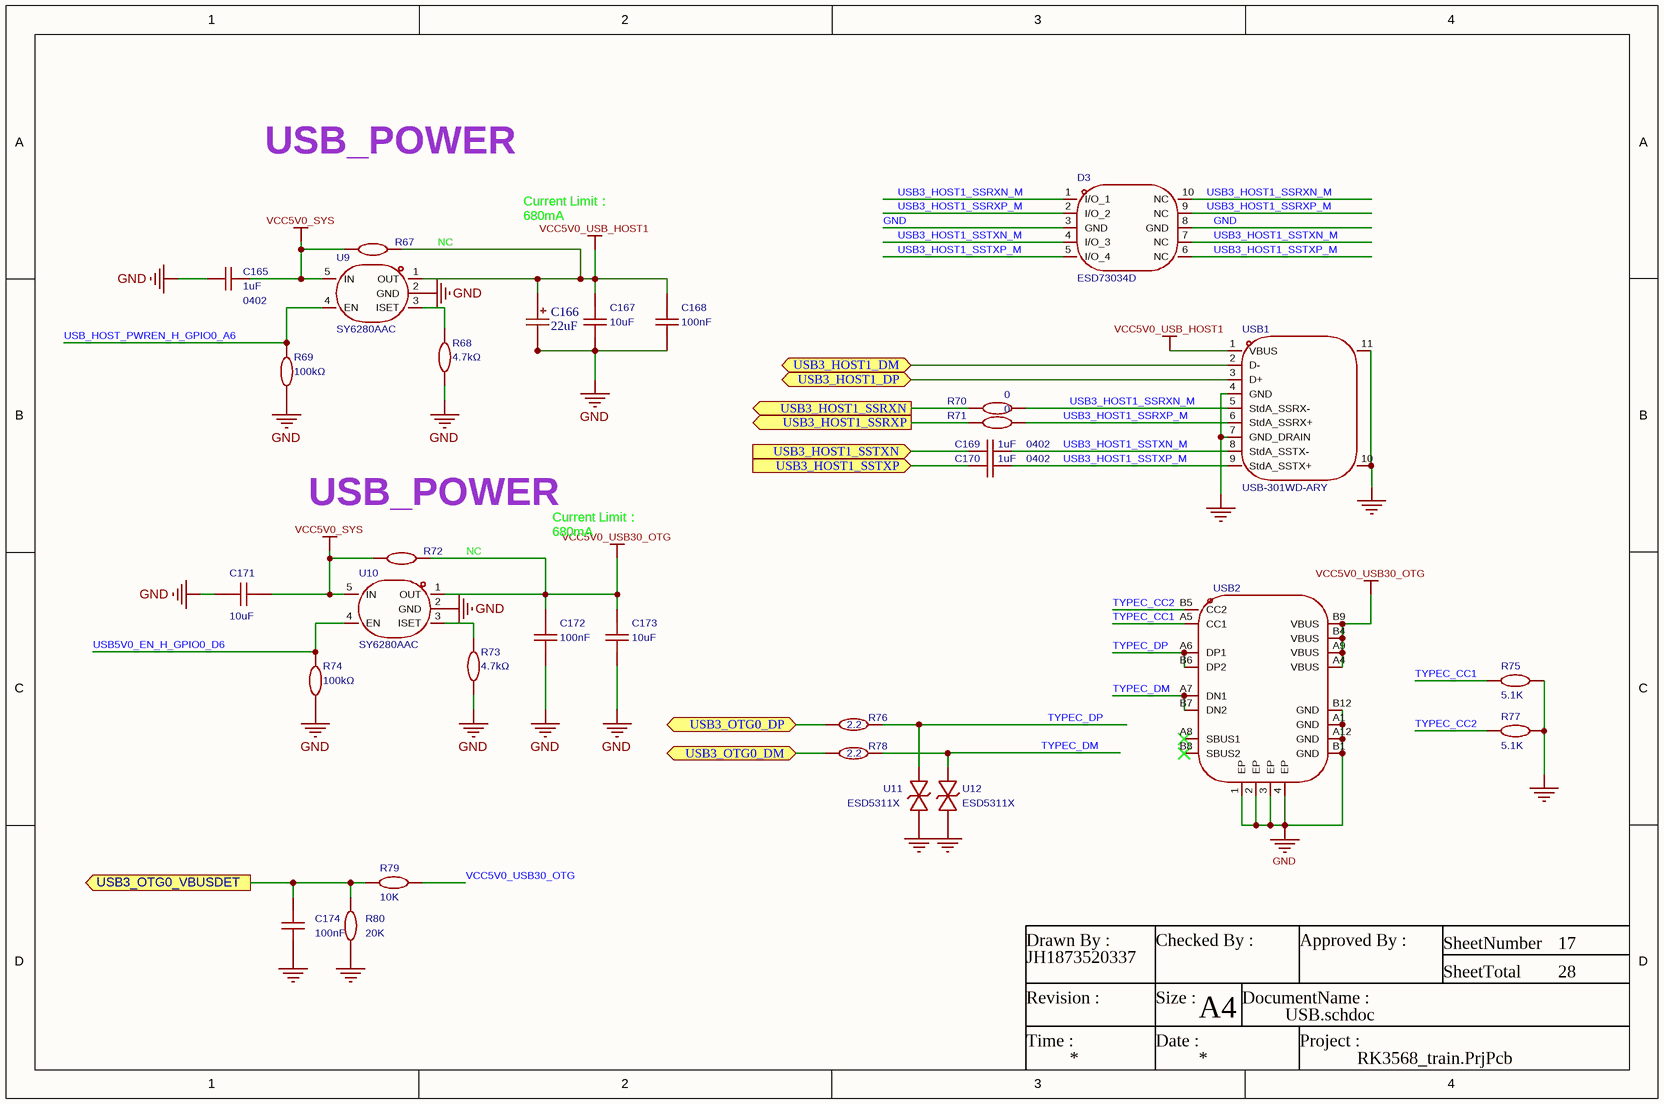
[diagram p16: USB.schdoc]

### Parts
C165  1uF  Supplier Footprint: 0402  [MYC0402]
C166  22uF  [CASE-B_3528]
C167  10uF  [C0603]
C168  100nF  [C0603]
C169  1uF  Supplier Footprint: 0402  [MYC0402]
C170  1uF  Supplier Footprint: 0402  [MYC0402]
C171  10uF  [C0603]
C172  100nF  [C0603]
C173  10uF  [C0603]
C174  value 100nF  [MYC0402]  (hidden comment: CL10A105KB8NNNC)
D3  ESD73034D  [DFN-10_L2.5-W1.0-P0.50-BL-2]
R67  NC  [R0805]
R68  4.7kΩ  [R0402]
R69  100kΩ  [R0402]
R70  0  [R0402]
R71  0  [R0402]
R72  NC  [R0805]
R73  4.7kΩ  [R0402]
R74  100kΩ  [R0402]
R75  5.1K  [R0402]
R76  2.2  [R0402]
R77  5.1K  [R0402]
R78  2.2  [R0402]
R79  10K  [R0402]
R80  20K  [R0402]
U9  SY6280AAC  [SOT-23-5_L3.0-W1.7-P0.95-LS2.8-BL]
U10  SY6280AAC  [SOT-23-5_L3.0-W1.7-P0.95-LS2.8-BL]
U11  ESD5311X  [DFN1006-2L-BI]
U12  ESD5311X  [DFN1006-2L-BI]
USB1  USB-301WD-ARY  [USB-TH_XUNPU_USB-301WD-ARY]
USB2  (no value)  [USB_TYPE-C-16P]

### Ports
USB3_HOST1_DM (bidir), USB3_HOST1_DP (bidir), USB3_HOST1_SSRXN (out), USB3_HOST1_SSRXP (out), USB3_HOST1_SSTXN (in), USB3_HOST1_SSTXP (in), USB3_OTG0_DM (bidir), USB3_OTG0_DP (bidir), USB3_OTG0_VBUSDET (out)

### Nets
GND: C165.1 C166.2 C167.1 C168.1 C171.1 C172.1 C173.1 C174.2 D3.3(GND) D3.8(GND) R68.1 R69.1 R73.1 R74.1 R75.1 R77.1 R80.1 U9.2(GND) U10.2(GND) U11.2 U12.2 USB1.4(GND) USB1.7(GND_DRAIN) USB1.10(SHIELD) USB1.11(SHIELD) USB2.1(EP) USB2.2(EP) USB2.3(EP) USB2.4(EP) USB2.A1(GND) USB2.A12(GND) USB2.B1(GND) USB2.B12(GND)
VCC5V0_SYS: C165.2 C171.2 R67.1 R72.1 U9.5(IN) U10.5(IN)
VCC5V0_USB30_OTG: C172.2 C173.2 R72.2 R79.2 U10.1(OUT) USB2.A4(VBUS) USB2.A9(VBUS) USB2.B4(VBUS) USB2.B9(VBUS)
VCC5V0_USB_HOST1: C166.1 C167.2 C168.2 R67.2 U9.1(OUT) USB1.1(VBUS)
TYPEC_CC1: R75.2 USB2.A5(CC1)
TYPEC_CC2: R77.2 USB2.B5(CC2)
TYPEC_DM: R78.2 U12.1 USB2.A7(DN1) USB2.B7(DN2)
TYPEC_DP: R76.2 U11.1 USB2.A6(DP1) USB2.B6(DP2)
USB3_HOST1_DM: USB1.2(D-) ; port USB3_HOST1_DM
USB3_HOST1_DP: USB1.3(D+) ; port USB3_HOST1_DP
USB3_HOST1_SSRXN: R70.1 ; port USB3_HOST1_SSRXN
USB3_HOST1_SSRXN_M: D3.1(I/O_1) D3.10(NC) R70.2 USB1.5(StdA_SSRX-)
USB3_HOST1_SSRXP: R71.1 ; port USB3_HOST1_SSRXP
USB3_HOST1_SSRXP_M: D3.2(I/O_2) D3.9(NC) R71.2 USB1.6(StdA_SSRX+)
USB3_HOST1_SSTXN: C169.1 ; port USB3_HOST1_SSTXN
USB3_HOST1_SSTXN_M: C169.2 D3.4(I/O_3) D3.7(NC) USB1.8(StdA_SSTX-)
USB3_HOST1_SSTXP: C170.1 ; port USB3_HOST1_SSTXP
USB3_HOST1_SSTXP_M: C170.2 D3.5(I/O_4) D3.6(NC) USB1.9(StdA_SSTX+)
USB3_OTG0_DM: R78.1 ; port USB3_OTG0_DM
USB3_OTG0_DP: R76.1 ; port USB3_OTG0_DP
USB3_OTG0_VBUSDET: C174.1 R79.1 R80.2 ; port USB3_OTG0_VBUSDET
USB5V0_EN_H_GPIO0_D6: R74.2 U10.4(EN)
USB_HOST_PWREN_H_GPIO0_A6: R69.2 U9.4(EN)
NetR68_2: R68.2 U9.3(ISET)
NetR73_2: R73.2 U10.3(ISET)

Not connected (* = marked no-connect by the designer): USB2 A8(SBUS1)* B8(SBUS2)*

### Notes on the sheet
- USB_POWER
- Current Limit：
  680mA
- (near R72) USB_POWER
- (near C173) Current Limit：
  680mA
- Drawn By :
- Checked By :
- Approved By :
- SheetNumber
- SheetTotal
- Revision :
- Time :
- Size :
- Date :
- A4
- DocumentName :
- Project :

### Library data of the parts
C165 = CL05A105KP5NNNC: 容值:1uF;精度:±10%;额定电压:10V;材质(温度系数):X5R;; Manufacturer: SAMSUNG(三星); Voltage Rated: 10V; 3D Model: 36a51122f27c49738f86b3bfa98863e0; 3D Model Transform: 39.37,19.685,0,0,0,0,0,0,0; Tolerance: ±10%; Temperature Coefficient: X5R; AddInBom: yes; ModelName: C0402_L1.0-W0.5-H0.5; Device: CL05A105KP5NNNC; Symbol: CL05A105KP5NNNC; LCSC Part Name: 1uF ±10% 10V; Supplier Part: C14445; Manufacturer Part: CL05A105KP5NNNC; JLCPCB Part Class: 扩展库; Datasheet: https://atta.szlcsc.com/upload/public/pdf/source/20160103/1457707670698.pdf; Supplier: LCSC; Value: 1uF; ConvertToPcb: yes; FootprintName: MYC0402
C166 = TAJB226K016RNJ: 容值:22uF;精度:±10%;额定电压:16V;等效串联电阻(ESR):2.3Ω@100kHz;; Manufacturer: Kyocera AVX; NPNP_COMPONENT_ID: C8020; Tolerance: ?0%; Voltage Rating: 16V; Equivalent Series Resistance(ESR): 2.3Ω@100kHz; JLCPCB Part Class: Extended Part; LCSC Part Name: 22uF ?0% 16V; Manufacturer Part: TAJB226K016RNJ; Operating Temperature: -55℃~+125℃; Supplier: LCSC; Supplier Footprint: CASE-B-3528-21(mm); Supplier Part: C8020; Value: 22uF
C167 C173 = CL10A106KP8NNNC: 容值:10uF;精度:±10%;额定电压:10V;材质(温度系数):X5R;; Manufacturer: SAMSUNG(三星); Symbol: 0603X106M100; AddInBom: yes; ModelId: ac125912035d415993ca9572d50418b1; ModelName: C0603_L1.6-W0.8-H0.8; ModelTransform: 62.992,31.496,0,0,0,0,0,0,0; Tolerance: ±10%; Voltage Rated: 10V; Temperature Coefficient: X5R; Device: CL10A106KP8NNNC; LCSC Part Name: 10uF ±10% 10V; SupplierPart: C19702; ManufacturerPart: CL10A106KP8NNNC; Supplier Footprint: 0603; JLCPCB Part Class: Basic Part; Datasheet: https://atta.szlcsc.com/upload/public/pdf/source/20160103/1457707703378.pdf; Supplier: LCSC; ConvertToPcb: yes; FootprintName: C0603; Value: 10uF
C168 C172 = CC0603KRX7R9BB104: 容值:100nF;精度:±10%;额定电压:50V;材质(温度系数):X7R;; Manufacturer: YAGEO(国巨); AddInBom: yes; ModelId: ac125912035d415993ca9572d50418b1; ModelName: C0603_L1.6-W0.8-H0.8; ModelTransform: 62.992,31.496,0,0,0,0,0,0,0; Tolerance: ±10%; Voltage Rated: 50V; Temperature Coefficient: X7R; Symbol: CC0603KRX7R9BB104; Device: CC0603KRX7R9BB104; LCSC Part Name: 100nF ±10% 50V; SupplierPart: C14663; ManufacturerPart: CC0603KRX7R9BB104; Supplier Footprint: 0603; JLCPCB Part Class: Basic Part; Datasheet: https://atta.szlcsc.com/upload/public/pdf/source/20180910/C282072_33301C7F631E79921B82A8DAC6BCC5B3.pdf; Supplier: LCSC; ConvertToPcb: yes; FootprintName: C0603; Value: 100nF
C169 C170 = CL05A105KP5NNNC: 容值:1uF;精度:±10%;额定电压:10V;材质(温度系数):X5R;; Manufacturer: SAMSUNG(三星); AddInBom: yes; ModelId: 36a51122f27c49738f86b3bfa98863e0; ModelName: C0402_L1.0-W0.5-H0.5; ModelTransform: 39.37,19.685,0,0,0,0,0,0,0; Tolerance: ±10%; Voltage Rated: 10V; Temperature Coefficient: X5R; Device: CL05A105KP5NNNC; Symbol: CL05A105KP5NNNC; LCSC Part Name: 1uF ±10% 10V; SupplierPart: C14445; ManufacturerPart: CL05A105KP5NNNC; JLCPCB Part Class: 扩展库; Datasheet: https://atta.szlcsc.com/upload/public/pdf/source/20160103/1457707670698.pdf; Supplier: LCSC; ConvertToPcb: yes; FootprintName: MYC0402; Value: 1uF
C171 = CAP_0603: as C139 on sheet SOC_DDR; Device: CAP_0603; Supplier Footprint: 0603; Value: 10uF; AddInBom: yes; FootprintName: C0603
C174 = CL10A105KB8NNNC: 容值:1uF;精度:±10%;额定电压:50V;材质(温度系数):X5R;; Manufacturer: SAMSUNG(三星); Symbol: CapAcitance; AddInBom: yes; ModelId: ac125912035d415993ca9572d50418b1; ModelName: C0603_L1.6-W0.8-H0.8; ModelTransform: 62.992,31.496,0,0,0,0,0,0,0; Tolerance: ±10%; Voltage Rated: 50V; Temperature Coefficient: X5R; Device: CL10A105KB8NNNC; LCSC Part Name: 1uF ±10% 50V; ManufacturerPart: CL10A105KB8NNNC; Supplier Footprint: 0603; JLCPCB Part Class: Basic Part; Datasheet: https://atta.szlcsc.com/upload/public/pdf/source/20160103/1457707679084.pdf; Supplier: LCSC; ConvertToPcb: yes; FootprintName: MYC0402
D3 = ESD73034D: 极性:双向;反向截止电压(Vrwm):3.3V;钳位电压:18V;峰值脉冲电流(Ipp):3A@8/20us;峰值脉冲功率(Ppp):60W@8/20us;击穿电压:8.5V;; Manufacturer: TECH PUBLIC(台舟); AddInBom: yes; ModelId: bdfd66bff1204c318d65223fd39cc645; ModelTransform: 40.1574,98.8187,0,90,0,0,0,0,0; Polarity: 双向; Reverse Stand-Off Voltage (Vrwm): 3.3V; Clamping Voltage: 18V; Voltage - Breakdown: 8.5V; Reverse Leakage Current (Ir): 200nA; Number of Channels: 四路; level of protection: IEC 61000-4-5；IEC 61000-4-2; Type: ESD; Junction Capacitance: 0.25pF; Symbol: ESD73034D; Device: ESD73034D; LCSC Part Name: ESD73034D-10/TR; SupplierPart: C7202962; ManufacturerPart: ESD73034D; Supplier Footprint: DFN2510-10; JLCPCB Part Class: 扩展库; Datasheet: https://item.szlcsc.com/datasheet/ESD73034D/8170920.html; Supplier: LCSC; ConvertToPcb: yes; FootprintName: DFN-10_L2.5-W1.0-P0.50-BL-2; ModelName: DFN-10_L2.5-W1.0-P0.50-BL-2; Peak Pulse Current (Ipp): 3A@8/20us; Peak Pulse Power Dissipation (Ppp): 60W@8/20us
R67 R72 = 0805W8F0000T5E: 电阻类型:厚膜电阻;阻值:0Ω;精度:±1%;功率:125mW;温度系数:±800ppm/℃;最大工作电压:150V;工作温度范围:-55℃~+155℃;; Manufacturer: UNI-ROYAL(厚声); AddInBom: yes; ModelId: 37a81e68749a4138bd2dfa6897b24b85; ModelName: R0805_L2.0-W1.3-H0.6; ModelTransform: 78.74,51.181,0,0,0,0,0,-0.0005,0; Tolerance: ±1%; Power(Watts): 125mW; Overload Voltage (Max): 150V; Supplier Part: NC; Value: NC; Device: 0805W8F0000T5E; Symbol: 0805W8F0000T5E; LCSC Part Name: 0Ω ±1% 125mW; ManufacturerPart: 0805W8F0000T5E; Supplier Footprint: 0805; JLCPCB Part Class: Basic Part; Datasheet: https://atta.szlcsc.com/upload/public/pdf/source/20200306/C422600_1E6D84923E4A46A82E41ADD87F860B5C.pdf; Supplier: LCSC; ConvertToPcb: yes; FootprintName: R0805; Type: 厚膜电阻; Temperature Coefficient: ±800ppm/℃; Operating Temperature Range: -55℃~+155℃
R68 R69 R73 R74 = CRCW040210K0FKED: 电阻类型:厚膜电阻;阻值:10kΩ;精度:±1%;功率:63mW;温度系数:±100ppm/K;最大工作电压:50V;工作温度范围:-55℃~+155℃;; Manufacturer: VISHAY(威世); AddInBom: yes; ModelId: 671aefced39d4c318694bba8bd8efd39; ModelName: R0402_L1.0-W0.5-H0.5; ModelTransform: 39.37,19.685,0,0,0,0,0,0.0005,0; Tolerance: ±1%; Power(Watts): 63mW; Overload Voltage (Max): 50V; Device: CRCW040210K0FKED; Symbol: CRCW040210K0FKED; LCSC Part Name: 10kΩ ±1% 63mW; ManufacturerPart: CRCW040210K0FKED; Supplier Footprint: 0402; JLCPCB Part Class: 扩展库; Datasheet: https://atta.szlcsc.com/upload/public/pdf/source/20180224/C71617_15194370300791364062.pdf; Supplier: LCSC; ConvertToPcb: yes; FootprintName: R0402; Type: 厚膜电阻; Temperature Coefficient: ±100ppm/K; Operating Temperature Range: -55℃~+155℃
  R68 R73: Value: 4.7kΩ
  R69 R74: Value: 100kΩ
R70 R71 R75-R80 = Res_0402: as R50 on sheet SOC_FLASH; Device: Res_0402; AddInBom: yes; Supplier Footprint: 0402; FootprintName: R0402
  R70 R71: Value: 0
  R75 R77: Value: 5.1K
  R76 R78: Value: 2.2
  R79: Value: 10K
  R80: Value: 20K
U9 U10 = SY6280AAC_C55136: 低能耗配电开关; Manufacturer: silergy(矽力杰); AddInBom: yes; ModelId: 0a2a1b8f50944f73965918ad6e5fe167; ModelName: SOT-23-5_L2.9-W1.6-H1.1-LS2.8-P0.95; ModelTransform: 118.60433,114.173,0,90,0,0,0.0005,0.0005,0; Device: SY6280AAC_C55136; Symbol: SY6280AAC; LCSC Part Name: SY6280AAC; SupplierPart: C55136; ManufacturerPart: SY6280AAC; Supplier Footprint: SOT-23-5; JLCPCB Part Class: Extended Part; Datasheet: https://atta.szlcsc.com/upload/public/pdf/source/20161108/1478586372822.pdf; Supplier: LCSC; ConvertToPcb: yes; FootprintName: SOT-23-5_L3.0-W1.7-P0.95-LS2.8-BL
U11 U12 = ESD5311X_C2844730: 极性:双向;反向截止电压(Vrwm):5V;最大钳位电压:21V;峰值脉冲电流(Ipp):4A;峰值脉冲功率(Ppp):80W;击穿电压:7.5V;; Manufacturer: TECH PUBLIC(台舟); AddInBom: yes; ModelId: 2bdbcca3b35b49c5a8ae725a08658930; ModelTransform: 40.1574,24.4094,0,0,0,0,0,0,0; polarity: 双向; Reverse Stand-Off Voltage (Vrwm): 5V; Maximum Clamping Voltage: 21V; Peak Pulse Current (Ipp): 4A; Peak Pulse Power Dissipation (Ppp): 80W; Breakdown Voltage: 7.5V; Reverse Leakage Current (Ir): 80nA; Number of Lines: 单路; level of protection: IEC 61000-4-2; Symbol: ESD5311X_C2844730; Device: ESD5311X_C2844730; LCSC Part Name: ESD5311X; SupplierPart: C2844730; ManufacturerPart: ESD5311X; Supplier Footprint: DFN1006-2; JLCPCB Part Class: 扩展库; Datasheet: https://atta.szlcsc.com/upload/public/pdf/source/20210709/C2844730_C8067B3CCE558E7D499244211FB5DC21.pdf; Supplier: LCSC; ConvertToPcb: yes; FootprintName: DFN1006-2L-BI; ModelName: DFN1006-2L-BI; Operating Temperature: -55℃~+125℃; Type: ESD
USB1 = USB-301WD-ARY: 连接器类型:Type-A;协议标准:USB 3.0;公母:母;安装方式:弯插;触点数量:9P;端口数量:1;额定电流 - 电源:1.8A;工作温度:-55℃~+85℃;; Manufacturer: XUNPU(讯普); AddInBom: yes; ModelId: 132fa2449e784102b2ac907af48270b0; ModelTransform: 622.05687,649.605,0,0,0,0,0,-209.84,-118.11; Connector Type: Type-A; Protocol Standard: USB 3.0; Gender: 母; Number of Contacts: 9P; Number of Ports: 1; Current Rating-Power: 1.8A; Voltage Rating: 30V; Detection color: 蓝色; Symbol: USB-301WD-ARY; Device: USB-301WD-ARY; LCSC Part Name: Type-A 母 弯插; SupplierPart: C2895025; ManufacturerPart: USB-301WD-ARY; Supplier Footprint: 插件; JLCPCB Part Class: 扩展库; Datasheet: https://item.szlcsc.com/datasheet/USB-301WD-ARY/3132962.html; Supplier: LCSC; ConvertToPcb: yes; FootprintName: USB-TH_XUNPU_USB-301WD-ARY; ModelName: USB-TH_XUNPU_USB-301WD-ARY; Mounting Type: 弯插; Length: 16.5mm; Operating Temperature: -55℃~+85℃
USB2 = USB_TYPE-C-16P: AddInBom: yes; ModelId: 35058e297fd54ee2afd2de30c3ce7155; ModelName: USB-C_SMD-TYPE-C-31-M-12; ModelTransform: 360,318.121,0,180,0,0,0,-41.02,-39.37; Device: USB_TYPE-C-16P; Symbol: USB_TYPE-C-16P; Supplier Footprint: SMD; ConvertToPcb: yes; FootprintName: USB_TYPE-C-16P

## Sheet PCIE.schdoc: =
size A4; Symbol: Sheet-Symbol_A4; Company: 嘉立创EDA; Version: V1.0; Page Size: A4; @Project Name: RK3568B2地瓜派; @Page Count: 27; @Update Date: 2025-09-15; @Create Date: 2025-09-12; @Schematic Name: Schematic1; @Page No: 27; @Page Name: PCIE; Device: Sheet-Symbol_A4; Border: 1; Title Block Position: 3; Width: 1170; Height: 825; Region Start: 1; X Region Count: 6; Y Region Count: 4; Blade Width: 10; @Board Name: Board1; @Create Time: 09:37:39; @Update Time: 13:48:42; Organization: ORGANIZATION; Address1: ADDRESS 1; Address2: ADDRESS 2; Address3: ADDRESS 3; Address4: ADDRESS 4; Revision: V1.0.0; SheetNumber: 18; SheetTotal: 28
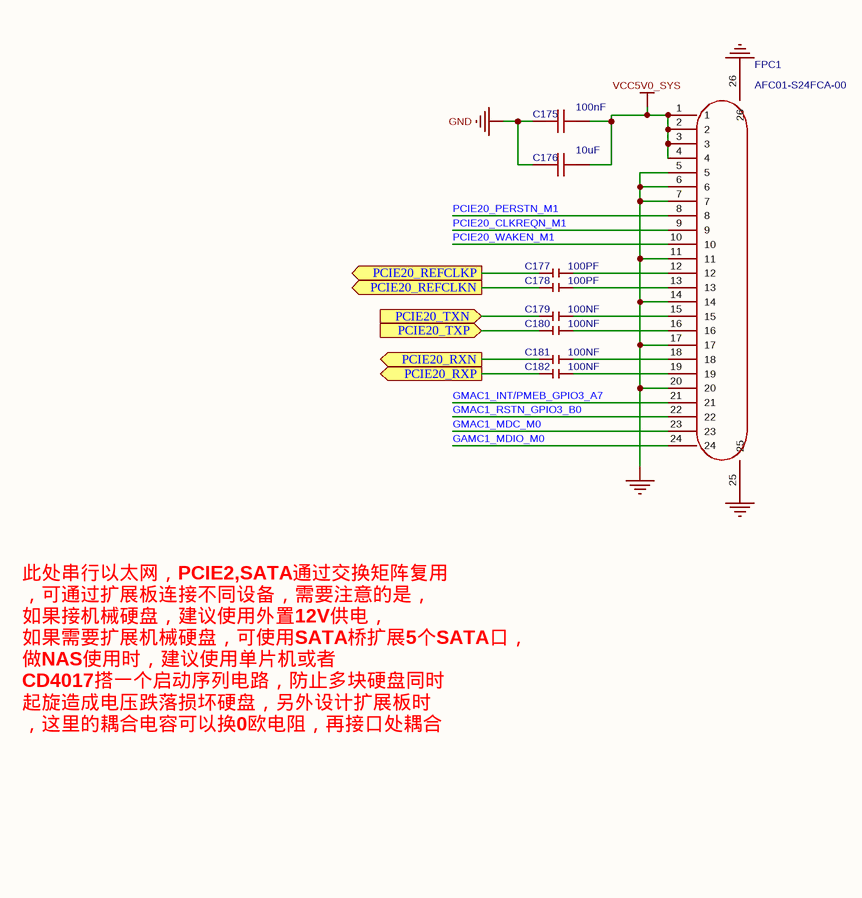
[diagram p17: PCIE.schdoc]

### Parts
C175  100nF  [C0603]
C176  10uF  [C0603]
C177  100PF  [MYC0402]
C178  100PF  [MYC0402]
C179  100NF  [MYC0402]
C180  100NF  [MYC0402]
C181  100NF  [MYC0402]
C182  100NF  [MYC0402]
FPC1  AFC01-S24FCA-00  [FPC-SMD_24P-P0.50_AFC01-S24FCA-00]

### Ports
PCIE20_REFCLKN (out), PCIE20_REFCLKP (out), PCIE20_RXN (out), PCIE20_RXP (out), PCIE20_TXN (in), PCIE20_TXP (in)

### Nets
GND: C175.1 C176.1 FPC1.5 FPC1.6 FPC1.7 FPC1.11 FPC1.14 FPC1.17 FPC1.20 FPC1.25 FPC1.26
VCC5V0_SYS: C175.2 C176.2 FPC1.1 FPC1.2 FPC1.3 FPC1.4
GAMC1_MDIO_M0: FPC1.24
GMAC1_INT/PMEB_GPIO3_A7: FPC1.21
GMAC1_MDC_M0: FPC1.23
GMAC1_RSTN_GPIO3_B0: FPC1.22
PCIE20_CLKREQN_M1: FPC1.9
PCIE20_PERSTN_M1: FPC1.8
PCIE20_REFCLKN: C178.1 ; port PCIE20_REFCLKN
PCIE20_REFCLKP: C177.1 ; port PCIE20_REFCLKP
PCIE20_RXN: C181.1 ; port PCIE20_RXN
PCIE20_RXP: C182.1 ; port PCIE20_RXP
PCIE20_TXN: C179.1 ; port PCIE20_TXN
PCIE20_TXP: C180.1 ; port PCIE20_TXP
PCIE20_WAKEN_M1: FPC1.10
NetC177_2: C177.2 FPC1.12
NetC178_2: C178.2 FPC1.13
NetC179_2: C179.2 FPC1.15
NetC180_2: C180.2 FPC1.16
NetC181_2: C181.2 FPC1.18
NetC182_2: C182.2 FPC1.19

### Notes on the sheet
- 此处串行以太网，PCIE2,SATA通过交换矩阵复用
  ，可通过扩展板连接不同设备，需要注意的是，
  如果接机械硬盘，建议使用外置12V供电，
  如果需要扩展机械硬盘，可使用SATA桥扩展5个SATA口，
  做NAS使用时，建议使用单片机或者
  CD4017搭一个启动序列电路，防止多块硬盘同时
  起旋造成电压跌落损坏硬盘，另外设计扩展板时
  ，这里的耦合电容可以换0欧电阻，再接口处耦合
- Drawn By :
- Checked By :
- Approved By :
- SheetNumber
- SheetTotal
- Revision :
- Time :
- Size :
- Date :
- A4
- DocumentName :
- Project :

### Library data of the parts
C175 C176 = CAP_0603: Symbol: Capacitance; ConvertToPcb: yes; ModelId: ac125912035d415993ca9572d50418b1聨0819f05c4eef4c71ace90d822a990e87; ModelName: C0603_L1.6-W0.8-H0.8; ModelTransform: 62.992,31.496,0,0,0,0,0,0,0; Device: CAP_0603; AddInBom: yes; Supplier Footprint: 0603; FootprintName: C0603
  C175: Value: 100nF
  C176: Value: 10uF
C177-C182 = MYC0402: C0402电容; Symbol: MY_C0201; AddInBom: yes; Device: MYC0402; ConvertToPcb: yes; FootprintName: MYC0402
  C177 C178: Value: 100PF
  C179-C182: Value: 100NF
FPC1 = AFC01-S24FCA-00: 锁定特性:翻盖式;触点类型:下接;触点数量:24P;间距:0.5mm;安装方式:卧贴;; Manufacturer: JS(钜硕电子); AddInBom: yes; ModelId: f4bf300ddc81445bb004d4c904d70ad0; ModelTransform: 645.668,240.157,0,0,0,0,0,-52.441,0; Locking Feature: 翻盖式; Number of Contacts: 24P; Pitch: 0.5mm; FFC, FCB Thickness: 0.3mm; Symbol: AFC01-S24FCA-00; Device: AFC01-S24FCA-00; LCSC Part Name: 间距:0.5mm P数:24P 翻盖式 下接; SupplierPart: C262669; ManufacturerPart: AFC01-S24FCA-00; Supplier Footprint: SMD,P=0.5mm,卧贴; JLCPCB Part Class: 扩展库; Datasheet: https://item.szlcsc.com/datasheet/AFC01-S24FCA-00/253928.html; Supplier: LCSC; ConvertToPcb: yes; FootprintName: FPC-SMD_24P-P0.50_AFC01-S24FCA-00; ModelName: FPC-SMD_24P-P0.50_AFC01-S24FCA-00; Contact Type: 下接; Mounting Type: 卧贴; Height Above Board: 2mm